# EAGLE design vr42-revA (EAGLE 9.6.2)

## Sheet 1 of 4
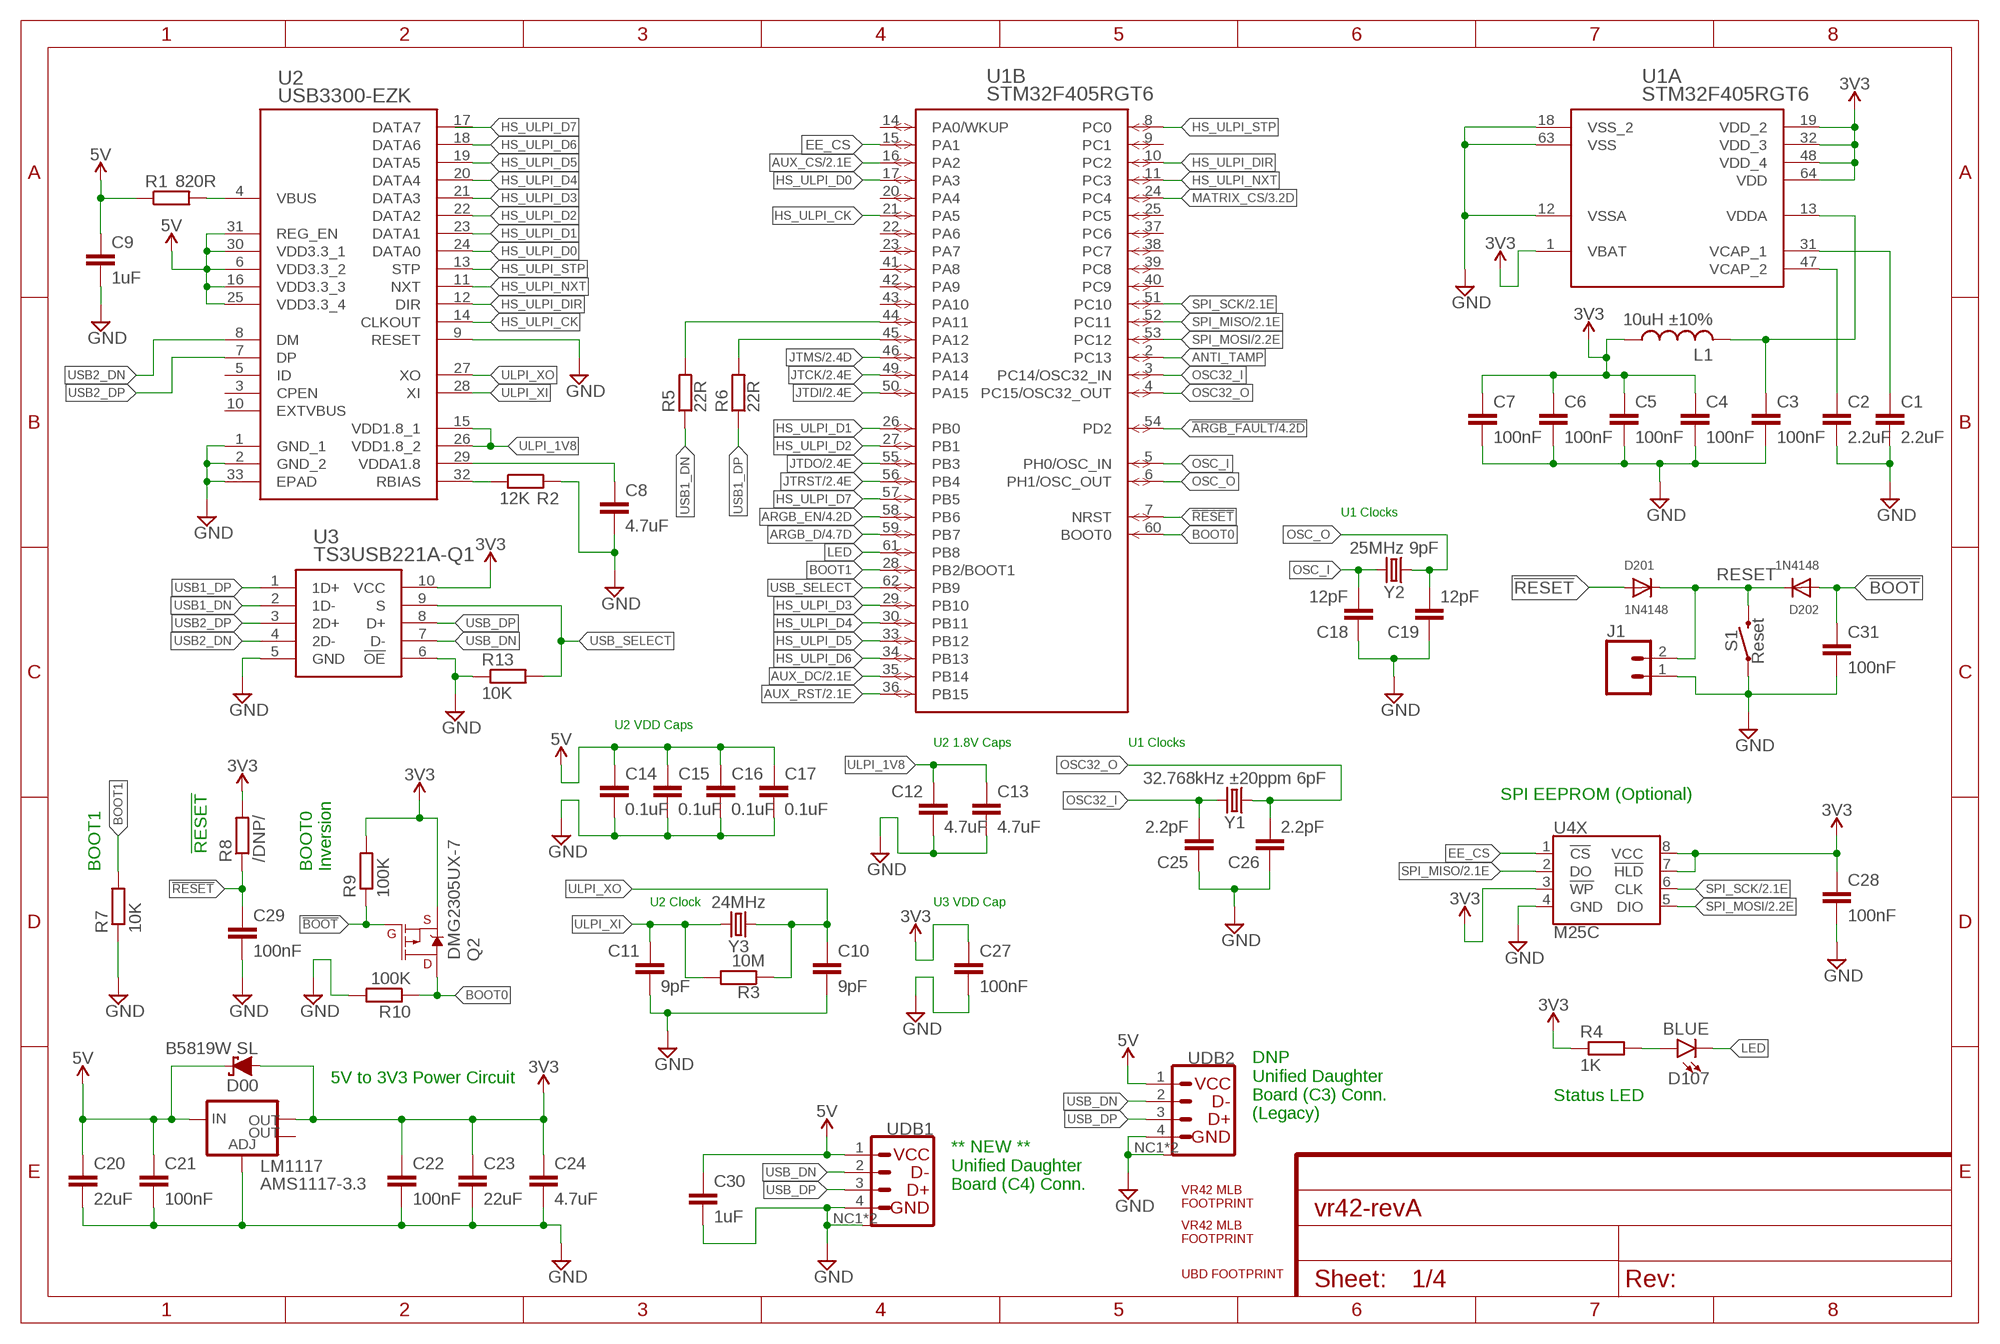
[diagram p0: schematic, sheet 1]

### Parts
C1  2.2uF  C-EUC0603  [C0603]
C2  2.2uF  C-EUC0603  [C0603]
C3  100nF  C-EUC0603  [C0603]
C4  100nF  C-EUC0603  [C0603]
C5  100nF  C-EUC0603  [C0603]
C6  100nF  C-EUC0603  [C0603]
C7  100nF  C-EUC0603  [C0603]
C8  4.7uF  C-EUC0603  [C0603]
C9  1uF  C-EUC0603  [C0603]
C10  9pF  C-EUC0603  [C0603]
C11  9pF  C-EUC0603  [C0603]
C12  4.7uF  C-EUC0603  [C0603]
C13  4.7uF  C-EUC0603  [C0603]
C14  0.1uF  C-EUC0603  [C0603]
C15  0.1uF  C-EUC0603  [C0603]
C16  0.1uF  C-EUC0603  [C0603]
C17  0.1uF  C-EUC0603  [C0603]
C18  12pF  C-EUC0603  [C0603]
C19  12pF  C-EUC0603  [C0603]
C20  22uF  0.22UF-0603-25V-10%  [0603]
C21  100nF  0.1UF-0603-25V-5%  [0603]
C22  100nF  0.1UF-0603-25V-5%  [0603]
C23  22uF  0.22UF-0603-25V-10%  [0603]
C24  4.7uF  1.0NF/1000PF-0603-50V-10%  [0603]
C25  2.2pF  C-EUC0603  [C0603]
C26  2.2pF  C-EUC0603  [C0603]
C27  100nF  C-EUC0603  [C0603]
C28  100nF  0.1UF-0603-25V-5%  [0603]
C29  100nF  C-EUC0603  [C0603]
C30  1uF  C-EUC0805  [C0805]
C31  100nF  C-EUC0805  [C0805]
D00  B5819W SL  1N5819WS  [SOD-123]
D107  BLUE  LED-BLUE0603  [LED-0603]
D201  1N4148  DIODESOT23_REFLOW  [SOT23-R]
D202  1N4148  DIODESOT23_REFLOW  [SOT23-R]
J1  CONN_02  [1X02]
L1  10uH ±10%  L-USL3225M  [L3225M]
LM1117  AMS1117-3.3  V_REG_LM1117SOT223  [SOT223]
Q2  DMG2305UX-7  MOSFET_PCH-DMG2305UX-7  [SOT23-3]
R1  820R  R-EU_R0603  [R0603]
R2  12K  R-EU_R0603  [R0603]
R3  10M  R-EU_R0603  [R0603]
R4  1K  R-EU_R0603  [R0603]
R5  22R  R-EU_R0603  [R0603]
R6  22R  R-EU_R0603  [R0603]
R7  10K  R-EU_R0603  [R0603]
R8  /DNP/  R-EU_R0603  [R0603]
R9  100K  R-EU_R0603  [R0603]
R10  100K  R-EU_R0603  [R0603]
R13  10K  R-EU_R0603  [R0603]
S1  Reset  MOMENTARY-SWITCH-SPST-SMD-5.2-TALL-REDUNDANT  [TACTILE_SWITCH_SMD_5.2MM]
U1  STM32F405RGT6  [LQFP64-10X10MM]
U2  USB3300-EZK  [QFN32_5X5MC_MCH]
U3  TS3USB221A-Q1  [RSE10]
U4X  M25C  [8-SOIC]
U$1  VR42_MLB_FOOTPRINT  [VR42_MLB_FOOTPRINT]
U$6  VR42_MLB_FOOTPRINT  [VR42_MLB_FOOTPRINT]
U$7  UBD_FOOTPRINT  [UDB_FOOTPRINT]
UDB1  UBD-S1_C4  [MOLEX_781710004]
UDB2  UBD-C3  [JST_SM04B-SRSS-TB_LF_SN]
Y1  32.768kHz ±20ppm 6pF  CRYSTAL-32.768KHZSMD-3.2X1.5  [CRYSTAL-SMD-3.2X1.5MM]
Y2  25MHz 9pF  CRYSTAL-24MHZ"  [CRYSTAL-SMD-5X3.2-4PAD]
Y3  24MHz  CRYSTAL-24MHZ"  [CRYSTAL-SMD-5X3.2-4PAD]

### Nets
!ARGB_FAULT: U1.54(B:PD2) ; also sheet 4
!BOOT: C31.1 D202.1(A) Q2.1(G) R9.1
!RESET: C29.1 D201.1(A) R8.1 U1.7(B:NRST)
ANTI_TAMP: U1.2(B:PC13)
ARGB_D: U1.59(B:PB7) ; also sheet 4
ARGB_EN: U1.58(B:PB6) ; also sheet 4
AUX_CS: U1.16(B:PA2) ; also sheet 2
AUX_DC: U1.35(B:PB14) ; also sheet 2
AUX_RST: U1.36(B:PB15) ; also sheet 2
BOOT0: Q2.3(D) R10.1 U1.60(B:BOOT0)
BOOT1: R7.2 U1.28(B:PB2/BOOT1)
EE_CS: U1.15(B:PA1) U4X.1(!CS)
GND: C1.2 C2.2 C3.2 C4.2 C5.2 C6.2 C7.2 C8.2 C9.2 C10.2 C11.2 C12.2 C13.2 C14.2 C15.2 C16.2 C17.2 C18.1 C19.1 C20.2 C21.2 C22.2 C23.2 C24.2 C25.1 C26.1 C27.2 C28.2 C29.2 C30.2 C31.2 J1.1 LM1117.1(ADJ) R2.2 R7.1 R10.2 R13.1 S1.1 S1.2 U1.12(A:VSSA) U1.18(A:VSS_2) U1.63(A:VSS) U2.1(GND_1) U2.2(GND_2) U2.9(RESET) U2.33(EPAD) U3.5(GND) U3.6(!OE) U4X.4(GND) UDB1.4(GND) UDB1.NC1(M) UDB1.NC2(M) UDB2.4(GND) UDB2.NC1(M) UDB2.NC2(M) ; also sheet 2,3,4
HS_ULPI_CK: U1.21(B:PA5) U2.14(CLKOUT)
HS_ULPI_D0: U1.17(B:PA3) U2.24(DATA0)
HS_ULPI_D1: U1.26(B:PB0) U2.23(DATA1)
HS_ULPI_D2: U1.27(B:PB1) U2.22(DATA2)
HS_ULPI_D3: U1.29(B:PB10) U2.21(DATA3)
HS_ULPI_D4: U1.30(B:PB11) U2.20(DATA4)
HS_ULPI_D5: U1.33(B:PB12) U2.19(DATA5)
HS_ULPI_D6: U1.34(B:PB13) U2.18(DATA6)
HS_ULPI_D7: U1.57(B:PB5) U2.17(DATA7)
HS_ULPI_DIR: U1.10(B:PC2) U2.12(DIR)
HS_ULPI_NXT: U1.11(B:PC3) U2.11(NXT)
HS_ULPI_STP: U1.8(B:PC0) U2.13(STP)
JTCK: U1.49(B:PA14) ; also sheet 2
JTDI: U1.50(B:PA15) ; also sheet 2
JTDO: U1.55(B:PB3) ; also sheet 2
JTMS: U1.46(B:PA13) ; also sheet 2
JTRST: U1.56(B:PB4) ; also sheet 2
LED: D107.C U1.61(B:PB8)
MATRIX_CS: U1.24(B:PC4) ; also sheet 3
N$9: R1.2 U2.4(VBUS)
N$10: R2.1 U2.32(RBIAS)
N$19: C8.1 U2.29(VDDA1.8)
N$140: R5.2 U1.44(B:PA11)
N$141: R6.2 U1.45(B:PA12)
N$145: D107.A R4.2
OSC32_I: C25.2 U1.3(B:PC14/OSC32_IN) Y1.P$2
OSC32_O: C26.2 U1.4(B:PC15/OSC32_OUT) Y1.P$1
OSC_I: C18.2 U1.5(B:PH0/OSC_IN) Y2.3
OSC_O: C19.2 U1.6(B:PH1/OSC_OUT) Y2.1
RESET: D201.3(C) D202.3(C) J1.2 S1.3 S1.4
SPI_MISO: U1.52(B:PC11) U4X.2(DO) ; also sheet 2,3
SPI_MOSI: U1.53(B:PC12) U4X.5(DIO) ; also sheet 2,3
SPI_SCK: U1.51(B:PC10) U4X.6(CLK) ; also sheet 2,3
ULPI_1V8: C12.1 C13.1 U2.15(VDD1.8_1) U2.26(VDD1.8_2)
ULPI_XI: C11.1 R3.2 U2.28(XI) Y3.3
ULPI_XO: C10.1 R3.1 U2.27(XO) Y3.1
USB1_DN: R5.1 U3.2(1D-)
USB1_DP: R6.1 U3.1(1D+)
USB2_DN: U2.8(DM) U3.4(2D-)
USB2_DP: U2.7(DP) U3.3(2D+)
USB_DN: U3.7(D-) UDB1.2(DN) UDB2.2(DN)
USB_DP: U3.8(D+) UDB1.3(DP) UDB2.3(DP)
USB_SELECT: R13.2 U1.62(B:PB9) U3.9(S)
VCAP_1: C1.1 U1.31(A:VCAP_1)
VCAP_2: C2.1 U1.47(A:VCAP_2)
VCC_1: C9.1 C14.1 C15.1 C16.1 C17.1 C20.1 C21.1 C30.1 D00.C LM1117.3(IN) R1.1 U2.6(VDD3.3_2) U2.16(VDD3.3_3) U2.25(VDD3.3_4) U2.30(VDD3.3_1) U2.31(REG_EN) UDB1.1(VCC) UDB2.1(VCC) ; supply symbol labelled 5V ; also sheet 4
VCC_2: C4.1 C5.1 C6.1 C7.1 C22.1 C23.1 C24.1 C27.1 C28.1 D00.A L1.1 LM1117.2(OUT) Q2.2(S) R4.1 R8.2 R9.2 U1.1(A:VBAT) U1.19(A:VDD_2) U1.32(A:VDD_3) U1.48(A:VDD_4) U1.64(A:VDD) U3.10(VCC) U4X.3(!WP) U4X.7(!HLD) U4X.8(VCC) ; supply symbol labelled 3V3 ; also sheet 2,3
VDDA: C3.1 L1.2 U1.13(A:VDDA)
Unconnected: LM1117.4(OUT) U1.9(B:PC1) U1.14(B:PA0/WKUP) U1.20(B:PA4) U1.22(B:PA6) U1.23(B:PA7) U1.25(B:PC5) U1.37(B:PC6) U1.38(B:PC7) U1.39(B:PC8) U1.40(B:PC9) U1.41(B:PA8) U1.42(B:PA9) U1.43(B:PA10) U2.3(CPEN) U2.5(ID) U2.10(EXTVBUS)

### Notes on the sheet
- U1 Clocks
- U2 VDD Caps
- U2 1.8V Caps | U1 Clocks
- SPI EEPROM (Optional)
- !RESET
- BOOT1
- BOOT0
  Inversion
- U2 Clock | U3 VDD Cap
- 5V to 3V3 Power Circuit
- Status LED
- DNP
  Unified Daughter
  Board (C3) Conn.
  (Legacy)
- ** NEW **
  Unified Daughter
  Board (C4) Conn.

## Sheet 2 of 4
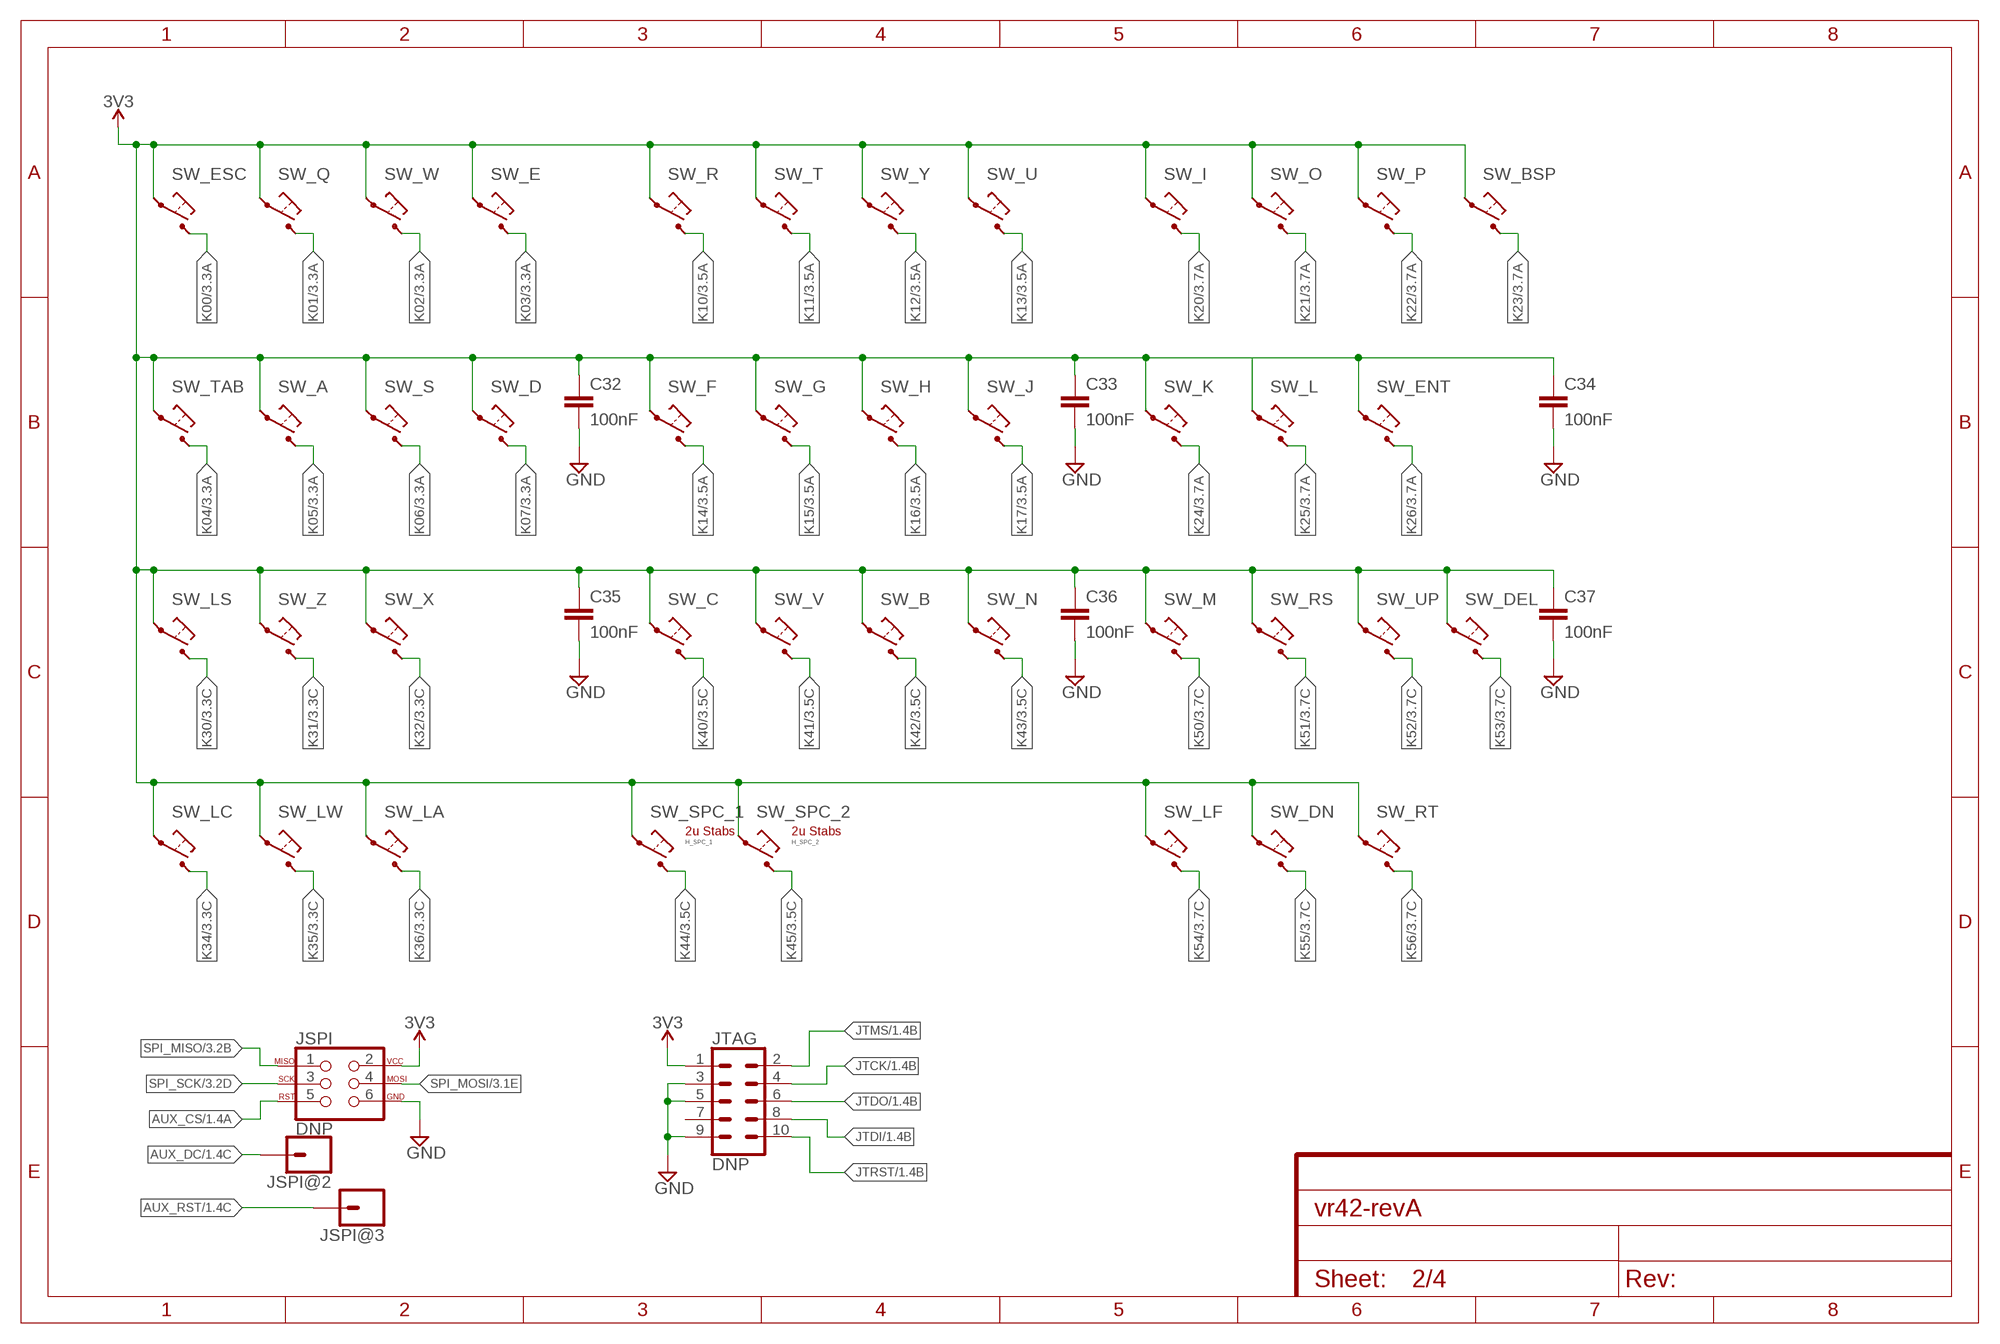
[diagram p1: schematic, sheet 2]

### Parts
C32  100nF  C-EUC0603  [C0603]
C33  100nF  C-EUC0603  [C0603]
C34  100nF  C-EUC0603  [C0603]
C35  100nF  C-EUC0603  [C0603]
C36  100nF  C-EUC0603  [C0603]
C37  100nF  C-EUC0603  [C0603]
H_SPC_1  MX-STABS-200U  [MX-STABS-200U]
H_SPC_2  MX-STABS-200U  [MX-STABS-200U]
JSPI  DNP  AVR_SPI_PROG_3X2NS  [2X3-NS]
JSPI@2  CONN_01  [1X01]
JSPI@3  CONN_01  [1X01]
JTAG  DNP  CONN_05X2NO_SILK  [2X5_NOSILK]
SW_A  MX-5-PIN-HOTSWAP-PAD  [MX-5-PIN-HOTSWAP-PAD]
SW_B  MX-5-PIN-HOTSWAP-PAD  [MX-5-PIN-HOTSWAP-PAD]
SW_BSP  MX-5-PIN-HOTSWAP-PAD  [MX-5-PIN-HOTSWAP-PAD]
SW_C  MX-5-PIN-HOTSWAP-PAD  [MX-5-PIN-HOTSWAP-PAD]
SW_D  MX-5-PIN-HOTSWAP-PAD  [MX-5-PIN-HOTSWAP-PAD]
SW_DEL  MX-5-PIN-HOTSWAP-PAD  [MX-5-PIN-HOTSWAP-PAD]
SW_DN  MX-5-PIN-HOTSWAP-PAD  [MX-5-PIN-HOTSWAP-PAD]
SW_E  MX-5-PIN-HOTSWAP-PAD  [MX-5-PIN-HOTSWAP-PAD]
SW_ENT  MX-5-PIN-HOTSWAP-PAD  [MX-5-PIN-HOTSWAP-PAD]
SW_ESC  MX-5-PIN-HOTSWAP-PAD  [MX-5-PIN-HOTSWAP-PAD]
SW_F  MX-5-PIN-HOTSWAP-PAD  [MX-5-PIN-HOTSWAP-PAD]
SW_G  MX-5-PIN-HOTSWAP-PAD  [MX-5-PIN-HOTSWAP-PAD]
SW_H  MX-5-PIN-HOTSWAP-PAD  [MX-5-PIN-HOTSWAP-PAD]
SW_I  MX-5-PIN-HOTSWAP-PAD  [MX-5-PIN-HOTSWAP-PAD]
SW_J  MX-5-PIN-HOTSWAP-PAD  [MX-5-PIN-HOTSWAP-PAD]
SW_K  MX-5-PIN-HOTSWAP-PAD  [MX-5-PIN-HOTSWAP-PAD]
SW_L  MX-5-PIN-HOTSWAP-PAD  [MX-5-PIN-HOTSWAP-PAD]
SW_LA  MX-5-PIN-HOTSWAP-PAD  [MX-5-PIN-HOTSWAP-PAD]
SW_LC  MX-5-PIN-HOTSWAP-PAD  [MX-5-PIN-HOTSWAP-PAD]
SW_LF  MX-5-PIN-HOTSWAP-PAD  [MX-5-PIN-HOTSWAP-PAD]
SW_LS  MX-5-PIN-HOTSWAP-PAD  [MX-5-PIN-HOTSWAP-PAD]
SW_LW  MX-5-PIN-HOTSWAP-PAD  [MX-5-PIN-HOTSWAP-PAD]
SW_M  MX-5-PIN-HOTSWAP-PAD  [MX-5-PIN-HOTSWAP-PAD]
SW_N  MX-5-PIN-HOTSWAP-PAD  [MX-5-PIN-HOTSWAP-PAD]
SW_O  MX-5-PIN-HOTSWAP-PAD  [MX-5-PIN-HOTSWAP-PAD]
SW_P  MX-5-PIN-HOTSWAP-PAD  [MX-5-PIN-HOTSWAP-PAD]
SW_Q  MX-5-PIN-HOTSWAP-PAD  [MX-5-PIN-HOTSWAP-PAD]
SW_R  MX-5-PIN-HOTSWAP-PAD  [MX-5-PIN-HOTSWAP-PAD]
SW_RS  MX-5-PIN-HOTSWAP-PAD  [MX-5-PIN-HOTSWAP-PAD]
SW_RT  MX-5-PIN-HOTSWAP-PAD  [MX-5-PIN-HOTSWAP-PAD]
SW_S  MX-5-PIN-HOTSWAP-PAD  [MX-5-PIN-HOTSWAP-PAD]
SW_SPC_1  MX-5-PIN-HOTSWAP-PAD  [MX-5-PIN-HOTSWAP-PAD]
SW_SPC_2  MX-5-PIN-HOTSWAP-PAD  [MX-5-PIN-HOTSWAP-PAD]
SW_T  MX-5-PIN-HOTSWAP-PAD  [MX-5-PIN-HOTSWAP-PAD]
SW_TAB  MX-5-PIN-HOTSWAP-PAD  [MX-5-PIN-HOTSWAP-PAD]
SW_U  MX-5-PIN-HOTSWAP-PAD  [MX-5-PIN-HOTSWAP-PAD]
SW_UP  MX-5-PIN-HOTSWAP-PAD  [MX-5-PIN-HOTSWAP-PAD]
SW_V  MX-5-PIN-HOTSWAP-PAD  [MX-5-PIN-HOTSWAP-PAD]
SW_W  MX-5-PIN-HOTSWAP-PAD  [MX-5-PIN-HOTSWAP-PAD]
SW_X  MX-5-PIN-HOTSWAP-PAD  [MX-5-PIN-HOTSWAP-PAD]
SW_Y  MX-5-PIN-HOTSWAP-PAD  [MX-5-PIN-HOTSWAP-PAD]
SW_Z  MX-5-PIN-HOTSWAP-PAD  [MX-5-PIN-HOTSWAP-PAD]

### Nets
AUX_CS: JSPI.5 ; also sheet 1
AUX_DC: JSPI@2.1 ; also sheet 1
AUX_RST: JSPI@3.1 ; also sheet 1
GND: C32.2 C33.2 C34.2 C35.2 C36.2 C37.2 JSPI.6 JTAG.3 JTAG.5 JTAG.9 ; also sheet 1,3,4
JTCK: JTAG.4 ; also sheet 1
JTDI: JTAG.8 ; also sheet 1
JTDO: JTAG.6 ; also sheet 1
JTMS: JTAG.2 ; also sheet 1
JTRST: JTAG.10 ; also sheet 1
K00: SW_ESC.1@1(P) SW_ESC.1@2(P) ; also sheet 3
K01: SW_Q.1@1(P) SW_Q.1@2(P) ; also sheet 3
K02: SW_W.1@1(P) SW_W.1@2(P) ; also sheet 3
K03: SW_E.1@1(P) SW_E.1@2(P) ; also sheet 3
K04: SW_TAB.1@1(P) SW_TAB.1@2(P) ; also sheet 3
K05: SW_A.1@1(P) SW_A.1@2(P) ; also sheet 3
K06: SW_S.1@1(P) SW_S.1@2(P) ; also sheet 3
K07: SW_D.1@1(P) SW_D.1@2(P) ; also sheet 3
K10: SW_R.1@1(P) SW_R.1@2(P) ; also sheet 3
K11: SW_T.1@1(P) SW_T.1@2(P) ; also sheet 3
K12: SW_Y.1@1(P) SW_Y.1@2(P) ; also sheet 3
K13: SW_U.1@1(P) SW_U.1@2(P) ; also sheet 3
K14: SW_F.1@1(P) SW_F.1@2(P) ; also sheet 3
K15: SW_G.1@1(P) SW_G.1@2(P) ; also sheet 3
K16: SW_H.1@1(P) SW_H.1@2(P) ; also sheet 3
K17: SW_J.1@1(P) SW_J.1@2(P) ; also sheet 3
K20: SW_I.1@1(P) SW_I.1@2(P) ; also sheet 3
K21: SW_O.1@1(P) SW_O.1@2(P) ; also sheet 3
K22: SW_P.1@1(P) SW_P.1@2(P) ; also sheet 3
K23: SW_BSP.1@1(P) SW_BSP.1@2(P) ; also sheet 3
K24: SW_K.1@1(P) SW_K.1@2(P) ; also sheet 3
K25: SW_L.1@1(P) SW_L.1@2(P) ; also sheet 3
K26: SW_ENT.1@1(P) SW_ENT.1@2(P) ; also sheet 3
K30: SW_LS.1@1(P) SW_LS.1@2(P) ; also sheet 3
K31: SW_Z.1@1(P) SW_Z.1@2(P) ; also sheet 3
K32: SW_X.1@1(P) SW_X.1@2(P) ; also sheet 3
K34: SW_LC.1@1(P) SW_LC.1@2(P) ; also sheet 3
K35: SW_LW.1@1(P) SW_LW.1@2(P) ; also sheet 3
K36: SW_LA.1@1(P) SW_LA.1@2(P) ; also sheet 3
K40: SW_C.1@1(P) SW_C.1@2(P) ; also sheet 3
K41: SW_V.1@1(P) SW_V.1@2(P) ; also sheet 3
K42: SW_B.1@1(P) SW_B.1@2(P) ; also sheet 3
K43: SW_N.1@1(P) SW_N.1@2(P) ; also sheet 3
K44: SW_SPC_1.1@1(P) SW_SPC_1.1@2(P) ; also sheet 3
K45: SW_SPC_2.1@1(P) SW_SPC_2.1@2(P) ; also sheet 3
K50: SW_M.1@1(P) SW_M.1@2(P) ; also sheet 3
K51: SW_RS.1@1(P) SW_RS.1@2(P) ; also sheet 3
K52: SW_UP.1@1(P) SW_UP.1@2(P) ; also sheet 3
K53: SW_DEL.1@1(P) SW_DEL.1@2(P) ; also sheet 3
K54: SW_LF.1@1(P) SW_LF.1@2(P) ; also sheet 3
K55: SW_DN.1@1(P) SW_DN.1@2(P) ; also sheet 3
K56: SW_RT.1@1(P) SW_RT.1@2(P) ; also sheet 3
SPI_MISO: JSPI.1 ; also sheet 1,3
SPI_MOSI: JSPI.4 ; also sheet 1,3
SPI_SCK: JSPI.3 ; also sheet 1,3
VCC_2: C32.1 C33.1 C34.1 C35.1 C36.1 C37.1 JSPI.2 JTAG.1 SW_A.2@1(S) SW_A.2@2(S) SW_B.2@1(S) SW_B.2@2(S) SW_BSP.2@1(S) SW_BSP.2@2(S) SW_C.2@1(S) SW_C.2@2(S) SW_D.2@1(S) SW_D.2@2(S) SW_DEL.2@1(S) SW_DEL.2@2(S) SW_DN.2@1(S) SW_DN.2@2(S) SW_E.2@1(S) SW_E.2@2(S) SW_ENT.2@1(S) SW_ENT.2@2(S) SW_ESC.2@1(S) SW_ESC.2@2(S) SW_F.2@1(S) SW_F.2@2(S) SW_G.2@1(S) SW_G.2@2(S) SW_H.2@1(S) SW_H.2@2(S) SW_I.2@1(S) SW_I.2@2(S) SW_J.2@1(S) SW_J.2@2(S) SW_K.2@1(S) SW_K.2@2(S) SW_L.2@1(S) SW_L.2@2(S) SW_LA.2@1(S) SW_LA.2@2(S) SW_LC.2@1(S) SW_LC.2@2(S) SW_LF.2@1(S) SW_LF.2@2(S) SW_LS.2@1(S) SW_LS.2@2(S) SW_LW.2@1(S) SW_LW.2@2(S) SW_M.2@1(S) SW_M.2@2(S) SW_N.2@1(S) SW_N.2@2(S) SW_O.2@1(S) SW_O.2@2(S) SW_P.2@1(S) SW_P.2@2(S) SW_Q.2@1(S) SW_Q.2@2(S) SW_R.2@1(S) SW_R.2@2(S) SW_RS.2@1(S) SW_RS.2@2(S) SW_RT.2@1(S) SW_RT.2@2(S) SW_S.2@1(S) SW_S.2@2(S) SW_SPC_1.2@1(S) SW_SPC_1.2@2(S) SW_SPC_2.2@1(S) SW_SPC_2.2@2(S) SW_T.2@1(S) SW_T.2@2(S) SW_TAB.2@1(S) SW_TAB.2@2(S) SW_U.2@1(S) SW_U.2@2(S) SW_UP.2@1(S) SW_UP.2@2(S) SW_V.2@1(S) SW_V.2@2(S) SW_W.2@1(S) SW_W.2@2(S) SW_X.2@1(S) SW_X.2@2(S) SW_Y.2@1(S) SW_Y.2@2(S) SW_Z.2@1(S) SW_Z.2@2(S) ; supply symbol labelled 3V3 ; also sheet 1,3
Unconnected: JTAG.7

## Sheet 3 of 4
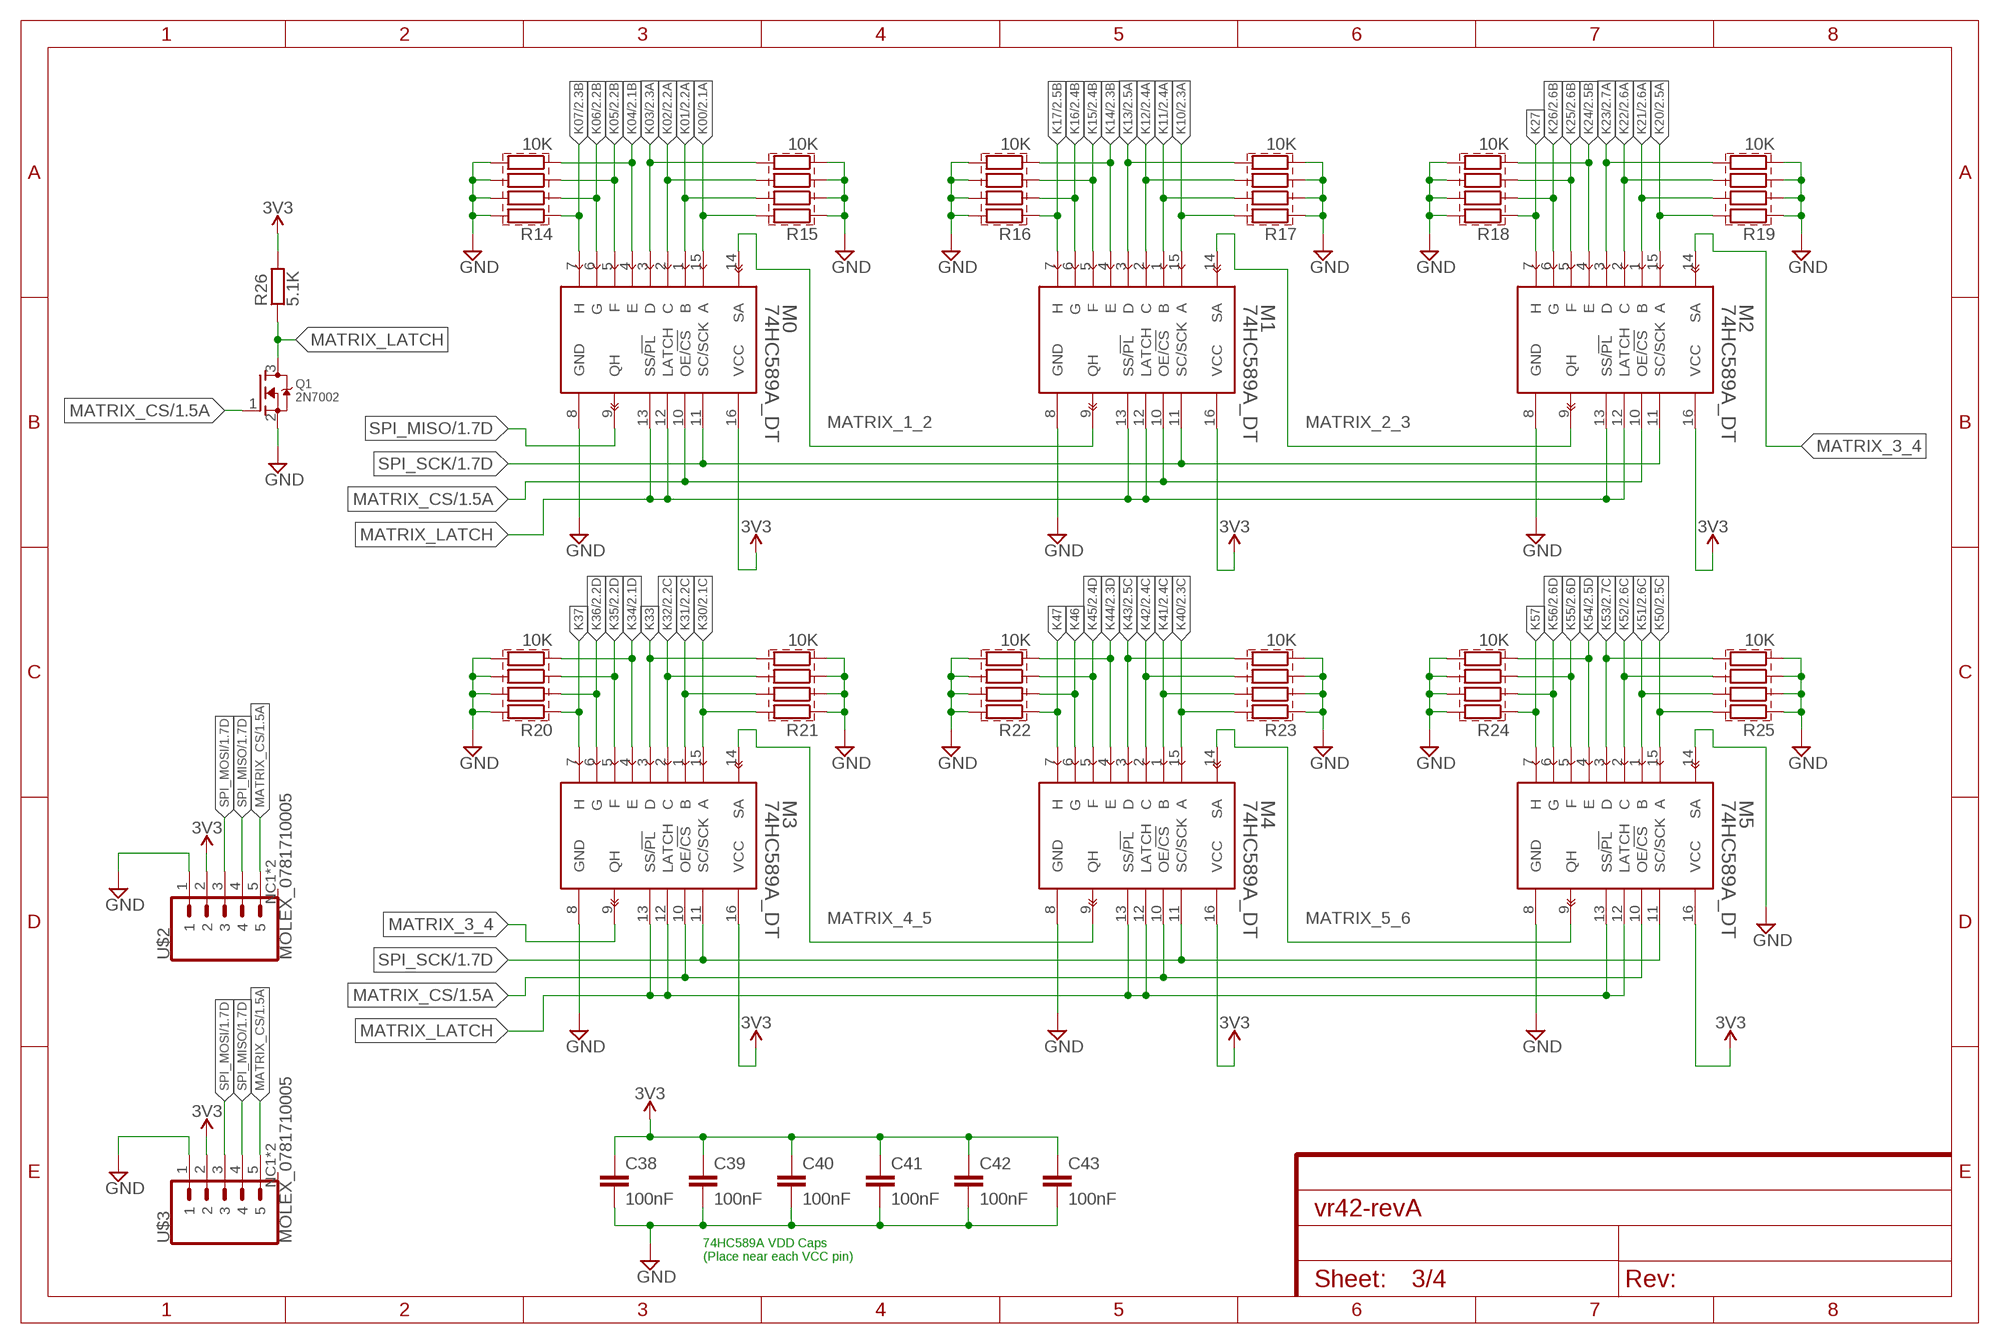
[diagram p2: schematic, sheet 3]

### Parts
C38  100nF  0.1UF-0603-25V-5%  [0603]
C39  100nF  0.1UF-0603-25V-5%  [0603]
C40  100nF  0.1UF-0603-25V-5%  [0603]
C41  100nF  0.1UF-0603-25V-5%  [0603]
C42  100nF  0.1UF-0603-25V-5%  [0603]
C43  100nF  0.1UF-0603-25V-5%  [0603]
M0  74HC589A_DT  [TSSOP16]
M1  74HC589A_DT  [TSSOP16]
M2  74HC589A_DT  [TSSOP16]
M3  74HC589A_DT  [TSSOP16]
M4  74HC589A_DT  [TSSOP16]
M5  74HC589A_DT  [TSSOP16]
Q1  2N7002  MOSFET-NREFLOW  [SOT23]
R14  10K  R-EU-4  [R0603X4]
R15  10K  R-EU-4  [R0603X4]
R16  10K  R-EU-4  [R0603X4]
R17  10K  R-EU-4  [R0603X4]
R18  10K  R-EU-4  [R0603X4]
R19  10K  R-EU-4  [R0603X4]
R20  10K  R-EU-4  [R0603X4]
R21  10K  R-EU-4  [R0603X4]
R22  10K  R-EU-4  [R0603X4]
R23  10K  R-EU-4  [R0603X4]
R24  10K  R-EU-4  [R0603X4]
R25  10K  R-EU-4  [R0603X4]
R26  5.1K  R-EU_R0603  [R0603]
U$2  MOLEX_0781710005  [MOLEX_781710005]
U$3  MOLEX_0781710005  [MOLEX_781710005]

### Nets
GND: C38.2 C39.2 C40.2 C41.2 C42.2 C43.2 M0.8(GND) M1.8(GND) M2.8(GND) M3.8(GND) M4.8(GND) M5.8(GND) M5.14(SA) Q1.2(S) R14.5 R14.6 R14.7 R14.8 R15.1 R15.2 R15.3 R15.4 R16.5 R16.6 R16.7 R16.8 R17.1 R17.2 R17.3 R17.4 R18.5 R18.6 R18.7 R18.8 R19.1 R19.2 R19.3 R19.4 R20.5 R20.6 R20.7 R20.8 R21.1 R21.2 R21.3 R21.4 R22.5 R22.6 R22.7 R22.8 R23.1 R23.2 R23.3 R23.4 R24.5 R24.6 R24.7 R24.8 R25.1 R25.2 R25.3 R25.4 U$2.1 U$3.1 ; also sheet 1,2,4
K00: M0.15(A) R15.8 ; also sheet 2
K01: M0.1(B) R15.7 ; also sheet 2
K02: M0.2(C) R15.6 ; also sheet 2
K03: M0.3(D) R15.5 ; also sheet 2
K04: M0.4(E) R14.4 ; also sheet 2
K05: M0.5(F) R14.3 ; also sheet 2
K06: M0.6(G) R14.2 ; also sheet 2
K07: M0.7(H) R14.1 ; also sheet 2
K10: M1.15(A) R17.8 ; also sheet 2
K11: M1.1(B) R17.7 ; also sheet 2
K12: M1.2(C) R17.6 ; also sheet 2
K13: M1.3(D) R17.5 ; also sheet 2
K14: M1.4(E) R16.4 ; also sheet 2
K15: M1.5(F) R16.3 ; also sheet 2
K16: M1.6(G) R16.2 ; also sheet 2
K17: M1.7(H) R16.1 ; also sheet 2
K20: M2.15(A) R19.8 ; also sheet 2
K21: M2.1(B) R19.7 ; also sheet 2
K22: M2.2(C) R19.6 ; also sheet 2
K23: M2.3(D) R19.5 ; also sheet 2
K24: M2.4(E) R18.4 ; also sheet 2
K25: M2.5(F) R18.3 ; also sheet 2
K26: M2.6(G) R18.2 ; also sheet 2
K27: M2.7(H) R18.1
K30: M3.15(A) R21.8 ; also sheet 2
K31: M3.1(B) R21.7 ; also sheet 2
K32: M3.2(C) R21.6 ; also sheet 2
K33: M3.3(D) R21.5
K34: M3.4(E) R20.4 ; also sheet 2
K35: M3.5(F) R20.3 ; also sheet 2
K36: M3.6(G) R20.2 ; also sheet 2
K37: M3.7(H) R20.1
K40: M4.15(A) R23.8 ; also sheet 2
K41: M4.1(B) R23.7 ; also sheet 2
K42: M4.2(C) R23.6 ; also sheet 2
K43: M4.3(D) R23.5 ; also sheet 2
K44: M4.4(E) R22.4 ; also sheet 2
K45: M4.5(F) R22.3 ; also sheet 2
K46: M4.6(G) R22.2
K47: M4.7(H) R22.1
K50: M5.15(A) R25.8 ; also sheet 2
K51: M5.1(B) R25.7 ; also sheet 2
K52: M5.2(C) R25.6 ; also sheet 2
K53: M5.3(D) R25.5 ; also sheet 2
K54: M5.4(E) R24.4 ; also sheet 2
K55: M5.5(F) R24.3 ; also sheet 2
K56: M5.6(G) R24.2 ; also sheet 2
K57: M5.7(H) R24.1
MATRIX_1_2: M0.14(SA) M1.9(QH)
MATRIX_2_3: M1.14(SA) M2.9(QH)
MATRIX_3_4: M2.14(SA) M3.9(QH)
MATRIX_4_5: M3.14(SA) M4.9(QH)
MATRIX_5_6: M4.14(SA) M5.9(QH)
MATRIX_CS: M0.10(OE/!CS) M1.10(OE/!CS) M2.10(OE/!CS) M3.10(OE/!CS) M4.10(OE/!CS) M5.10(OE/!CS) Q1.1(G) U$2.5 U$3.5 ; also sheet 1
MATRIX_LATCH: M0.12(LATCH) M0.13(SS/!PL) M1.12(LATCH) M1.13(SS/!PL) M2.12(LATCH) M2.13(SS/!PL) M3.12(LATCH) M3.13(SS/!PL) M4.12(LATCH) M4.13(SS/!PL) M5.12(LATCH) M5.13(SS/!PL) Q1.3(D) R26.1
SPI_MISO: M0.9(QH) U$2.4 U$3.4 ; also sheet 1,2
SPI_MOSI: U$2.3 U$3.3 ; also sheet 1,2
SPI_SCK: M0.11(SC/SCK) M1.11(SC/SCK) M2.11(SC/SCK) M3.11(SC/SCK) M4.11(SC/SCK) M5.11(SC/SCK) ; also sheet 1,2
VCC_2: C38.1 C39.1 C40.1 C41.1 C42.1 C43.1 M0.16(VCC) M1.16(VCC) M2.16(VCC) M3.16(VCC) M4.16(VCC) M5.16(VCC) R26.2 U$2.2 U$3.2 ; supply symbol labelled 3V3 ; also sheet 1,2
Unconnected: U$2.NC1(M) U$2.NC2(M) U$3.NC1(M) U$3.NC2(M)

### Notes on the sheet
- 74HC589A VDD Caps
  (Place near each VCC pin)

## Sheet 4 of 4
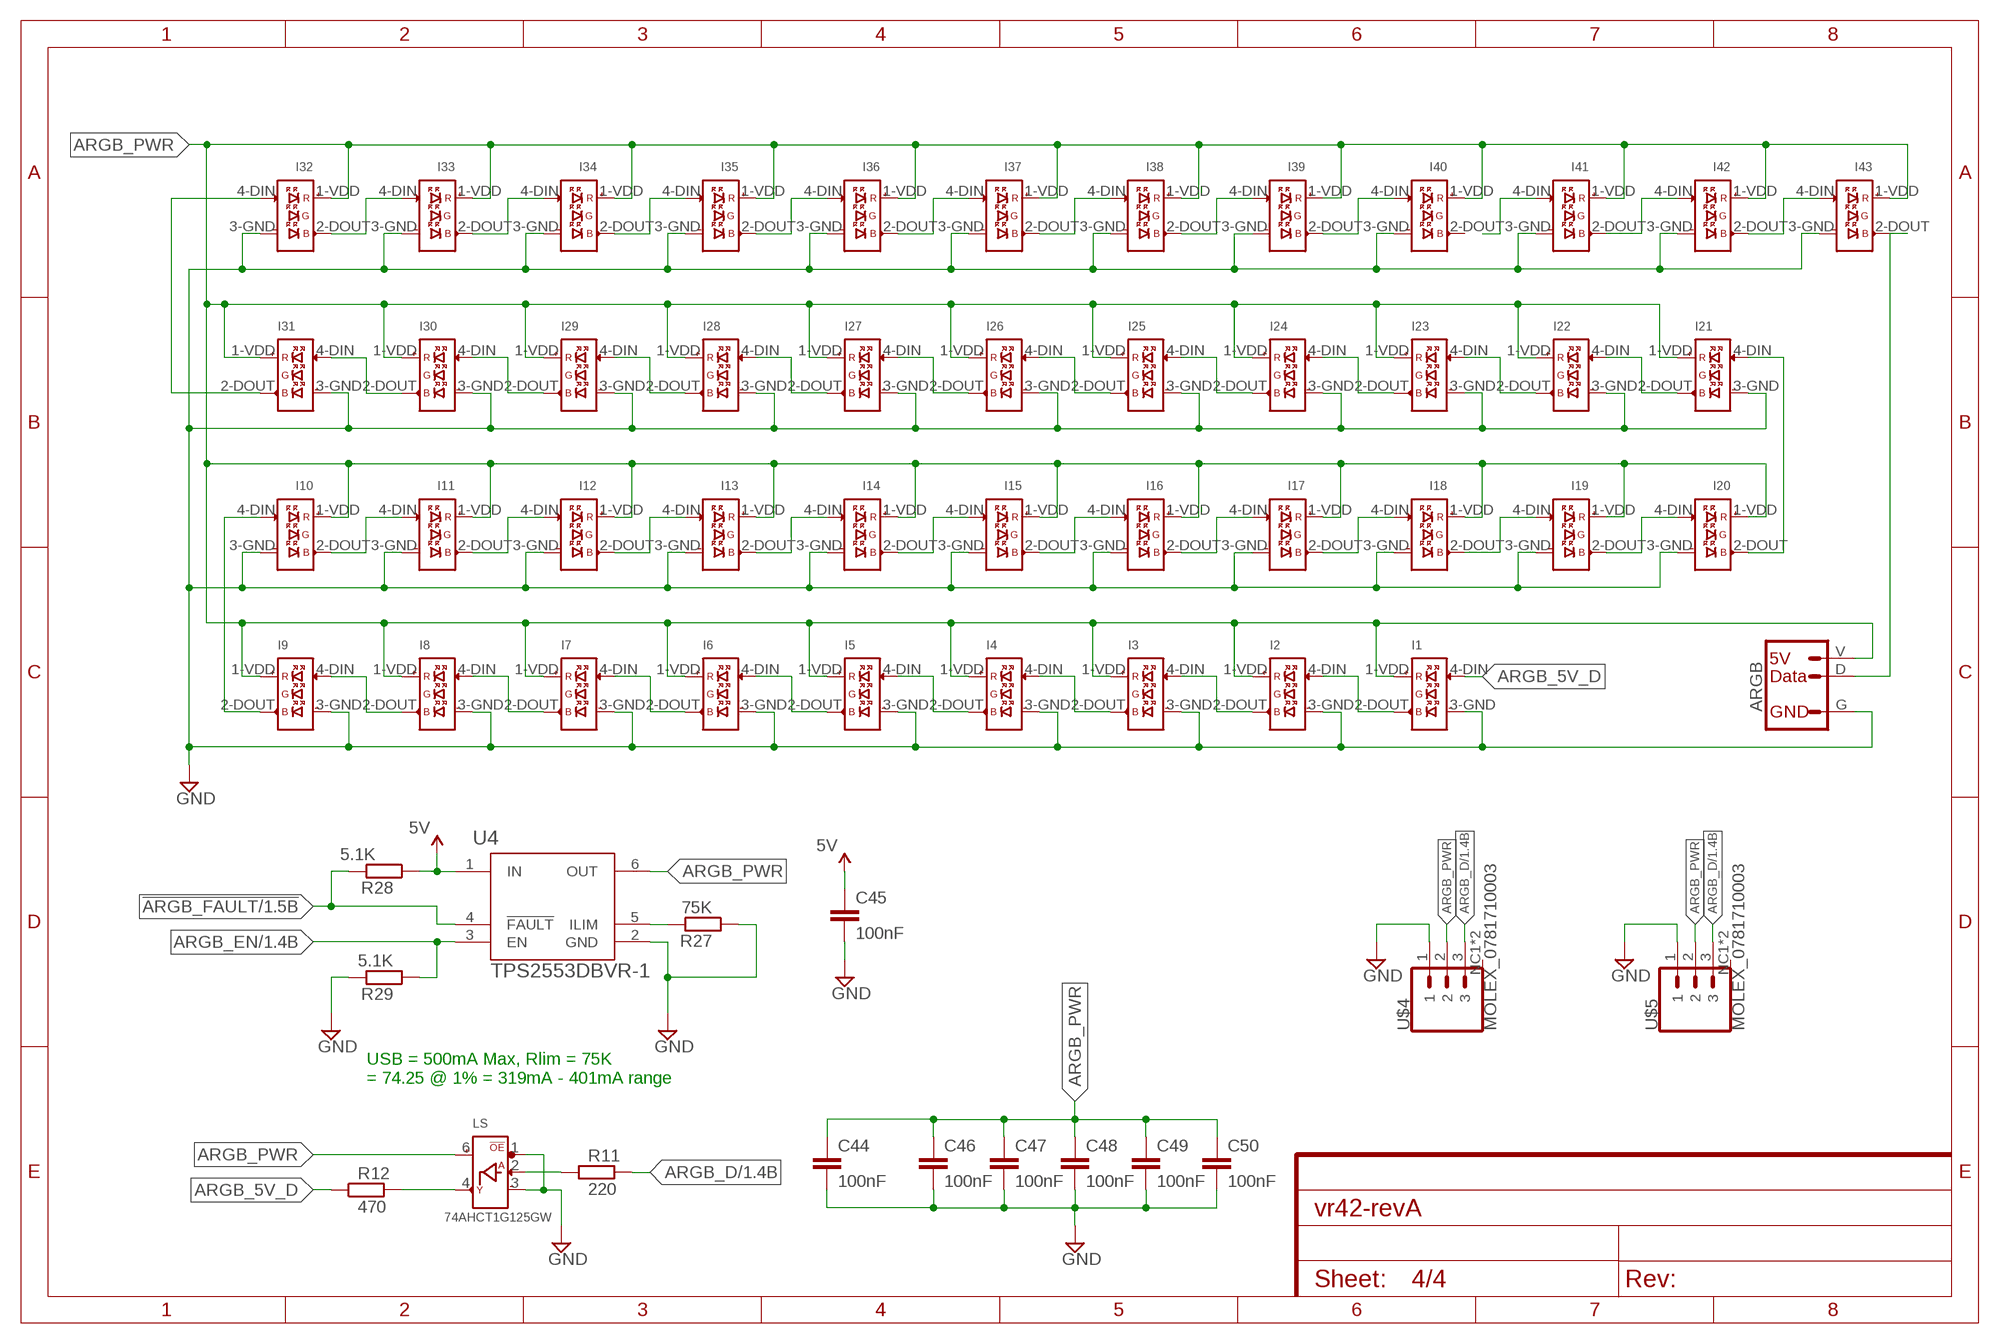
[diagram p3: schematic, sheet 4]

### Parts
C44  100nF  C-EUC0603  [C0603]
C45  100nF  C-EUC0603  [C0603]
C46  100nF  C-EUC0603  [C0603]
C47  100nF  C-EUC0603  [C0603]
C48  100nF  C-EUC0603  [C0603]
C49  100nF  C-EUC0603  [C0603]
C50  100nF  C-EUC0603  [C0603]
I1  SK6812-E-REVERSE  [SK6812-E-MILL]
I2  SK6812-E-REVERSE  [SK6812-E-MILL]
I3  SK6812-E-REVERSE  [SK6812-E-MILL]
I4  SK6812-E-REVERSE  [SK6812-E-MILL]
I5  SK6812-E-REVERSE  [SK6812-E-MILL]
I6  SK6812-E-REVERSE  [SK6812-E-MILL]
I7  SK6812-E-REVERSE  [SK6812-E-MILL]
I8  SK6812-E-REVERSE  [SK6812-E-MILL]
I9  SK6812-E-REVERSE  [SK6812-E-MILL]
I10  SK6812-E-REVERSE  [SK6812-E-MILL]
I11  SK6812-E-REVERSE  [SK6812-E-MILL]
I12  SK6812-E-REVERSE  [SK6812-E-MILL]
I13  SK6812-E-REVERSE  [SK6812-E-MILL]
I14  SK6812-E-REVERSE  [SK6812-E-MILL]
I15  SK6812-E-REVERSE  [SK6812-E-MILL]
I16  SK6812-E-REVERSE  [SK6812-E-MILL]
I17  SK6812-E-REVERSE  [SK6812-E-MILL]
I18  SK6812-E-REVERSE  [SK6812-E-MILL]
I19  SK6812-E-REVERSE  [SK6812-E-MILL]
I20  SK6812-E-REVERSE  [SK6812-E-MILL]
I21  SK6812-E-REVERSE  [SK6812-E-MILL]
I22  SK6812-E-REVERSE  [SK6812-E-MILL]
I23  SK6812-E-REVERSE  [SK6812-E-MILL]
I24  SK6812-E-REVERSE  [SK6812-E-MILL]
I25  SK6812-E-REVERSE  [SK6812-E-MILL]
I26  SK6812-E-REVERSE  [SK6812-E-MILL]
I27  SK6812-E-REVERSE  [SK6812-E-MILL]
I28  SK6812-E-REVERSE  [SK6812-E-MILL]
I29  SK6812-E-REVERSE  [SK6812-E-MILL]
I30  SK6812-E-REVERSE  [SK6812-E-MILL]
I31  SK6812-E-REVERSE  [SK6812-E-MILL]
I32  SK6812-E-REVERSE  [SK6812-E-MILL]
I33  SK6812-E-REVERSE  [SK6812-E-MILL]
I34  SK6812-E-REVERSE  [SK6812-E-MILL]
I35  SK6812-E-REVERSE  [SK6812-E-MILL]
I36  SK6812-E-REVERSE  [SK6812-E-MILL]
I37  SK6812-E-REVERSE  [SK6812-E-MILL]
I38  SK6812-E-REVERSE  [SK6812-E-MILL]
I39  SK6812-E-REVERSE  [SK6812-E-MILL]
I40  SK6812-E-REVERSE  [SK6812-E-MILL]
I41  SK6812-E-REVERSE  [SK6812-E-MILL]
I42  SK6812-E-REVERSE  [SK6812-E-MILL]
I43  SK6812-E-REVERSE  [SK6812-E-MILL]
I44  ARGB  [ARGB]
LS  74AHCT1G125GW  [SC-88A__TSSOP5__SOT353-1]
R11  220  R-EU_R0603  [R0603]
R12  470  R-EU_R0603  [R0603]
R27  75K  R-EU_R0603  [R0603]
R28  5.1K  R-EU_R0603  [R0603]
R29  5.1K  R-EU_R0603  [R0603]
U4  TPS2553DBVR-1  [DBV0006A_N]
U$4  MOLEX_0781710003  [MOLEX_781710003]
U$5  MOLEX_0781710003  [MOLEX_781710003]

### Nets
!ARGB_FAULT: R28.2 U4.4(!FAULT) ; also sheet 1
ARGB_5V_D: I1.4-DIN(4_DIN) R12.1
ARGB_D: R11.2 U$4.3 U$5.3 ; also sheet 1
ARGB_EN: R29.1 U4.3(EN) ; also sheet 1
ARGB_PWR: C44.1 C46.1 C47.1 C48.1 C49.1 C50.1 I1.1-VDD(1_VDD) I2.1-VDD(1_VDD) I3.1-VDD(1_VDD) I4.1-VDD(1_VDD) I5.1-VDD(1_VDD) I6.1-VDD(1_VDD) I7.1-VDD(1_VDD) I8.1-VDD(1_VDD) I9.1-VDD(1_VDD) I10.1-VDD(1_VDD) I11.1-VDD(1_VDD) I12.1-VDD(1_VDD) I13.1-VDD(1_VDD) I14.1-VDD(1_VDD) I15.1-VDD(1_VDD) I16.1-VDD(1_VDD) I17.1-VDD(1_VDD) I18.1-VDD(1_VDD) I19.1-VDD(1_VDD) I20.1-VDD(1_VDD) I21.1-VDD(1_VDD) I22.1-VDD(1_VDD) I23.1-VDD(1_VDD) I24.1-VDD(1_VDD) I25.1-VDD(1_VDD) I26.1-VDD(1_VDD) I27.1-VDD(1_VDD) I28.1-VDD(1_VDD) I29.1-VDD(1_VDD) I30.1-VDD(1_VDD) I31.1-VDD(1_VDD) I32.1-VDD(1_VDD) I33.1-VDD(1_VDD) I34.1-VDD(1_VDD) I35.1-VDD(1_VDD) I36.1-VDD(1_VDD) I37.1-VDD(1_VDD) I38.1-VDD(1_VDD) I39.1-VDD(1_VDD) I40.1-VDD(1_VDD) I41.1-VDD(1_VDD) I42.1-VDD(1_VDD) I43.1-VDD(1_VDD) I44.V LS.6(5_VCC) U4.6(OUT) U$4.2 U$5.2
GND: C44.2 C45.2 C46.2 C47.2 C48.2 C49.2 C50.2 I1.3-GND(3_GND) I2.3-GND(3_GND) I3.3-GND(3_GND) I4.3-GND(3_GND) I5.3-GND(3_GND) I6.3-GND(3_GND) I7.3-GND(3_GND) I8.3-GND(3_GND) I9.3-GND(3_GND) I10.3-GND(3_GND) I11.3-GND(3_GND) I12.3-GND(3_GND) I13.3-GND(3_GND) I14.3-GND(3_GND) I15.3-GND(3_GND) I16.3-GND(3_GND) I17.3-GND(3_GND) I18.3-GND(3_GND) I19.3-GND(3_GND) I20.3-GND(3_GND) I21.3-GND(3_GND) I22.3-GND(3_GND) I23.3-GND(3_GND) I24.3-GND(3_GND) I25.3-GND(3_GND) I26.3-GND(3_GND) I27.3-GND(3_GND) I28.3-GND(3_GND) I29.3-GND(3_GND) I30.3-GND(3_GND) I31.3-GND(3_GND) I32.3-GND(3_GND) I33.3-GND(3_GND) I34.3-GND(3_GND) I35.3-GND(3_GND) I36.3-GND(3_GND) I37.3-GND(3_GND) I38.3-GND(3_GND) I39.3-GND(3_GND) I40.3-GND(3_GND) I41.3-GND(3_GND) I42.3-GND(3_GND) I43.3-GND(3_GND) I44.G LS.1(!OE) LS.3(3_GND) R27.1 R29.2 U4.2(GND) U$4.1 U$5.1 ; also sheet 1,2,3
LED1ST: LS.2(A_DIN) R11.1
N$3: I9.2-DOUT(2_DOUT) I10.4-DIN(4_DIN)
N$4: I32.2-DOUT(2_DOUT) I33.4-DIN(4_DIN)
N$5: I33.2-DOUT(2_DOUT) I34.4-DIN(4_DIN)
N$6: I34.2-DOUT(2_DOUT) I35.4-DIN(4_DIN)
N$7: I35.2-DOUT(2_DOUT) I36.4-DIN(4_DIN)
N$8: I36.2-DOUT(2_DOUT) I37.4-DIN(4_DIN)
N$11: I37.2-DOUT(2_DOUT) I38.4-DIN(4_DIN)
N$12: I38.2-DOUT(2_DOUT) I39.4-DIN(4_DIN)
N$13: I39.2-DOUT(2_DOUT) I40.4-DIN(4_DIN)
N$14: I23.2-DOUT(2_DOUT) I24.4-DIN(4_DIN)
N$15: I24.2-DOUT(2_DOUT) I25.4-DIN(4_DIN)
N$16: I25.2-DOUT(2_DOUT) I26.4-DIN(4_DIN)
N$17: I26.2-DOUT(2_DOUT) I27.4-DIN(4_DIN)
N$18: I27.2-DOUT(2_DOUT) I28.4-DIN(4_DIN)
N$20: I29.2-DOUT(2_DOUT) I30.4-DIN(4_DIN)
N$21: I30.2-DOUT(2_DOUT) I31.4-DIN(4_DIN)
N$22: I20.2-DOUT(2_DOUT) I21.4-DIN(4_DIN)
N$23: I10.2-DOUT(2_DOUT) I11.4-DIN(4_DIN)
N$24: I11.2-DOUT(2_DOUT) I12.4-DIN(4_DIN)
N$25: I12.2-DOUT(2_DOUT) I13.4-DIN(4_DIN)
N$26: I13.2-DOUT(2_DOUT) I14.4-DIN(4_DIN)
N$27: I14.2-DOUT(2_DOUT) I15.4-DIN(4_DIN)
N$28: I15.2-DOUT(2_DOUT) I16.4-DIN(4_DIN)
N$29: I16.2-DOUT(2_DOUT) I17.4-DIN(4_DIN)
N$30: I41.4-DIN(4_DIN)
N$31: I5.2-DOUT(2_DOUT) I6.4-DIN(4_DIN)
N$32: I6.2-DOUT(2_DOUT) I7.4-DIN(4_DIN)
N$33: I7.2-DOUT(2_DOUT) I8.4-DIN(4_DIN)
N$34: I8.2-DOUT(2_DOUT) I9.4-DIN(4_DIN)
N$36: I31.2-DOUT(2_DOUT) I32.4-DIN(4_DIN)
N$37: I43.2-DOUT(2_DOUT) I44.D
N$38: R27.2 U4.5(ILIM)
N$40: I19.2-DOUT(2_DOUT) I20.4-DIN(4_DIN)
N$41: I41.2-DOUT(2_DOUT) I42.4-DIN(4_DIN)
N$42: I28.2-DOUT(2_DOUT) I29.4-DIN(4_DIN)
N$46: I1.2-DOUT(2_DOUT) I2.4-DIN(4_DIN)
N$47: I42.2-DOUT(2_DOUT) I43.4-DIN(4_DIN)
N$48: I21.2-DOUT(2_DOUT) I22.4-DIN(4_DIN)
N$49: I22.2-DOUT(2_DOUT) I23.4-DIN(4_DIN)
N$50: I2.2-DOUT(2_DOUT) I3.4-DIN(4_DIN)
N$51: I3.2-DOUT(2_DOUT) I4.4-DIN(4_DIN)
N$52: I4.2-DOUT(2_DOUT) I5.4-DIN(4_DIN)
N$54: I17.2-DOUT(2_DOUT) I18.4-DIN(4_DIN)
N$55: I18.2-DOUT(2_DOUT) I19.4-DIN(4_DIN)
N$66: LS.4(Y_DOUT) R12.2
VCC_1: C45.1 R28.1 U4.1(IN) ; supply symbol labelled 5V ; also sheet 1
Unconnected: I40.2-DOUT(2_DOUT) U$4.NC1(M) U$4.NC2(M) U$5.NC1(M) U$5.NC2(M)

### Notes on the sheet
- USB = 500mA Max, Rlim = 75K
  = 74.25 @ 1% = 319mA - 401mA range

## Library data of the parts
C1-C19 C25-C27 C29-C37 C44-C50 = rcl:C-EU: CAPACITOR, European symbol; SPICEPREFIX: C
C20 C23 = SparkFun-Capacitors:0.22UF: 0.22µF ceramic capacitors A capacitor is a passive two-terminal electrical component used to store electrical energy temporarily in an electric field.; PROD_ID: CAP-07822; VALUE: 0.22uF
C21 C22 C28 C38-C43 = SparkFun-Capacitors:0.1UF: 0.1µF ceramic capacitors A capacitor is a passive two-terminal electrical component used to store electrical energy temporarily in an electric field.; PROD_ID: CAP-08604; VALUE: 0.1uF
C24 = SparkFun-Capacitors:1.0NF/1000PF: 1nF/1,000pF ceramic capacitors A capacitor is a passive two-terminal electrical component used to store electrical energy temporarily in an electric field.; PROD_ID: CAP-07886; VALUE: 1nF
D00 = jlcpcb_basic_parts:1N5819WS: JLCPCB Part # C8598 Description 40V 600mV@1A 1A SOD-123 Schottky Barrier Diodes (SBD) ROHS Schottky Diode
D107 = SparkFun-LED:LED-BLUE: Blue SMD LED Used in manufacturing of various products at SparkFun Packages: 0603 - SMD 0603 package [Product Link] <http://www.digikey.com/product-detail/en/SMLE12BC7TT86/511-1589-2-ND/1641808> 1206 - SMD1206 package [Product Link] <http://www.digikey.com/product-detail/en/lite-on-inc/LTST-C150TBKT/160-1643-1-ND/573584> SparkFun Products: ESP8266 Thing-Dev Board <https://www.sparkfun.com/products/13711> RedBoard <https://www.sparkfun.com/products/12757>; PROD_ID: DIO-08575
D201 D202 = adafruit:DIODE: Diode SMADIODE - SMA Surface Mount Package 20V 1A Schottky Diode Digikey: 641-1014-6-ND DO-1N4148 - Through Hole Small Current Diode SOD-123 20V 1 A (.5mV Vf) Schottky Diode - Digikey: MBRX120TPMSCT-ND SOD-323 10V 570mA (.38mV Vf, 3ns) Schottky Diode - Digikey: ZLLS410CT-ND SOD-523 30V 30mA Schottky Diode (RB751S-40TE61) - Digikey: RB751S-40TE61CT-ND SOT23-R/W - SOT23 Package (R = Solder Paste/Reflow Ovens, W = Hand-Soldering) BAT54Film 40V 300mA - Digikey: 497-7162-1-ND
H_SPC_1 H_SPC_2 = ts_keyboards:MX-STABS-200U
I1-I43 = ts_keyboards:SK6812-E-REVERSE
I44 = __temp_to_delete:ARGB
J1 = SparkFun-Connectors:CONN_02: Multi connection point. Often used as Generic Header-pin footprint for 0.1 inch spaced/style header connections On any of the 0.1 inch spaced packages, you can populate with these: Break Away Headers - Straight <https://www.sparkfun.com/products/116> (PRT-00116) Break Away Male Headers - Right Angle <https://www.sparkfun.com/products/553> (PRT-00553) Female Headers <https://www.sparkfun.com/products/115> (PRT-00115) Break Away Headers - Machine Pin <https://www.sparkfun.com/products/117> (PRT-00117) Break Away Female Headers - Swiss Machine Pin <https://www.sparkfun.com/products/743> (PRT-00743) For SCREWTERMINALS and SPRING TERMINALS visit here: Screw Terimnals on SparkFun.com <https://www.sparkfun.com/search/results?term=Screw+Terminals> (5mm/3.5mm/2.54mm spacing) This device is also useful as a general connection point to wire up your design to another part of your project. Our various solder wires solder well into these plated through hole pads. Hook-Up Wire - Assortment (Stranded, 22 AWG) <https://www.sparkfun.com/products/11375> (PRT-11375) Hook-Up Wire - Assortment (Solid Core, 22 AWG) <https://www.sparkfun.com/products/11367> (PRT-11367) View the entire wire category on our website here <https://www.sparkfun.com/categories/141> Special notes: Molex polarized connector foot print use with: PRT-08233 with associated crimp pins and housings. 2.54_SCREWTERM for use with PRT-10571. 3.5mm Screw Terminal footprints for PRT-08084 5mm Screw Terminal footprints for use with PRT-08432
JSPI = SparkFun-Connectors:AVR_SPI_PROG_3X2: AVR ISP 6 Pin This is the reduced ISP connector for AVR programming. Common on Arduino. This footprint will take up less PCB space and can be used with a 10-pin to 6-pin adapter such as SKU: BOB-08508 **Special note about "TEST_POINT" package. The stop mask is on the top side, so if you want your programming test points to be on the bottom of your board, make sure to place this package on the bottom side of the board. This also ensure that the orientation to program from the bottom side will be correct. SparkFun Products: SparkFun ISP Pogo Adapter <https://www.sparkfun.com/products/11591> - NS Tiny AVR Programmer <https://www.sparkfun.com/products/11801> -PTH
JSPI@2 JSPI@3 = SparkFun-Connectors:CONN_01: Single connection point. Often used as Generic Header-pin footprint for 0.1 inch spaced/style header connections On any of the 0.1 inch spaced packages, you can populate with these: Break Away Headers - Straight <https://www.sparkfun.com/products/116> (PRT-00116) Break Away Male Headers - Right Angle <https://www.sparkfun.com/products/553> (PRT-00553) Female Headers <https://www.sparkfun.com/products/115> (PRT-00115) Break Away Headers - Machine Pin <https://www.sparkfun.com/products/117> (PRT-00117) Break Away Female Headers - Swiss Machine Pin <https://www.sparkfun.com/products/743> (PRT-00743) This device is also useful as a general connection point to wire up your design to another part of your project. Our various solder wires solder well into these plated through hole pads. Hook-Up Wire - Assortment (Stranded, 22 AWG) <https://www.sparkfun.com/products/11375> (PRT-11375) Hook-Up Wire - Assortment (Solid Core, 22 AWG) <https://www.sparkfun.com/products/11367> (PRT-11367) View the entire wire category on our website here <https://www.sparkfun.com/categories/141> Special notes: SMTSO-256-ET is a "flush mount" nut for a 4-40 screw. We mostly use this on specialty testbeds; it is a nice way to connect hardware to your PCB at an adjustable hieght. Also note, the SNAP packages are for using a snappable style connector. We sell a baggie of snaps and they are also used on two LilyPad designs: Snap Assortment - 30 pack (male and female) <https://www.sparkfun.com/products/11347> (DEV-11347) LilyPad Arduino SimpleSnap <https://www.sparkfun.com/products/10941> (DEV-10941) LilyPad SimpleSnap Protoboard <https://www.sparkfun.com/products/10940> (DEV-10940)
JTAG = SparkFun-Connectors:CONN_05X2: Multi connection point. Often used as Generic Header-pin footprint for 0.1 inch spaced/style header connections For AVR SPI programming port, see special device with nice symbol: "AVR_SPI_PROG_5x2.dev" You can populate with any combo of single row headers, but if you'd like an exact match, check these: 2x5 AVR ICSP Male Header <https://www.sparkfun.com/products/778> (PRT-00778) 2x5 Pin Shrouded Header <https://www.sparkfun.com/products/8506> (PRT-08506) On any of the 0.1 inch spaced packages, you can populate with these: Break Away Headers - Straight <https://www.sparkfun.com/products/116> (PRT-00116) Break Away Male Headers - Right Angle <https://www.sparkfun.com/products/553> (PRT-00553) Female Headers <https://www.sparkfun.com/products/115> (PRT-00115) Break Away Headers - Machine Pin <https://www.sparkfun.com/products/117> (PRT-00117) Break Away Female Headers - Swiss Machine Pin <https://www.sparkfun.com/products/743> (PRT-00743) Special note: the shrouded connector mates well with our 5x2 ribbon cables: 2x5 Pin IDC Ribbon Cable <https://www.sparkfun.com/products/8535> (PRT-08535)
L1 = rcl:L-US: INDUCTOR, American symbol; SPICEPREFIX: L
LM1117 = SparkFun-IC-Power:V_REG_LM1117: Voltage Regulator LM1117 Standard adjustable voltage regulator but in SMD form. Spark Fun Electronics SKU : COM-00595; PROD_ID: VREG-08170
LS = ts_keyboards:74AHCT1G125GW
M0 M1-M5 = __untitled:74HC589A_DT
Q1 = adafruit:MOSFET-N: N-Channel Mosfet 2N7002E - 60V 260mA SOT23 [Digikey: 2N7002ET1GOSTR-ND] - REEL BSH103 - 30V 850mA SOT23 [Digikey: 568-5013-1-ND]
Q2 = SparkFun-DiscreteSemi:MOSFET_PCH: P-channel MOSFETs Voltage controlled devices that allow control of high current outputs. SparkFun Products: SparkFun ESP32 Thing <https://www.sparkfun.com/products/13907> SparkFun ESP8266 Thing <https://www.sparkfun.com/products/13231> SparkFun Pi Servo HAT V2 <https://www.sparkfun.com/products/15316> DMG2305UX-7 (20V/4.2A/SOT23-3); PROD_ID: TRAN-14388; VALUE: 20V/4.2A/52mΩ/1.4W
R1-R13 R26-R29 = rcl:R-EU_: RESISTOR, European symbol; SPICEPREFIX: R
R14-R25 = ts_keyboards:R-EU-4
S1 = SparkFun-Switches:MOMENTARY-SWITCH-SPST: Momentary Switch (Pushbutton) - SPST Normally-open (NO) SPST momentary switches (buttons, pushbuttons). Variants PTH-12MM - 12mm square, through-hole Momentary Pushbutton Switch - 12mm Square <https://www.sparkfun.com/products/9190> (COM-09190) PTH-6.0MM, PTH-6.0MM-KIT - 6.0mm square, through-hole Mini Pushbutton Switch <https://www.sparkfun.com/products/97> (COM-00097) KIT package intended for soldering kit's - only one side of pads' copper is exposed. PTH-RIGHT-ANGLE-KIT - Right-angle, through-hole Right Angle Tactile Button <https://www.sparkfun.com/products/10791> - Used on SparkFun BigTime Watch Kit <https://www.sparkfun.com/products/11734> SMD-12MM - 12mm square, surface-mount Tactile Button - SMD (12mm) <https://www.sparkfun.com/products/12993> (COM-12993) Used on SparkFun PicoBoard <https://www.sparkfun.com/products/11888> SMD-4.5MM - 4.5mm Square Trackball Switch Used on SparkFun Blackberry Trackballer Breakout <https://www.sparkfun.com/products/13169> SMD-4.6MMX2.8MM - 4.60mm x 2.80mm, surface mount Used on SparkFun SAMD21 Mini Breakout <https://www.sparkfun.com/products/13664> SMD-5.2MM, SMD-5.2-REDUNDANT - 5.2mm square, surface-mount Mini Pushbutton Switch - SMD <https://www.sparkfun.com/products/8720> (COM-08720) Used on Arduino Pro Mini <https://www.sparkfun.com/products/11114> REDUNDANT package connects both switch circuits together SMD-6.0X3.5MM - 6.0 x 3.5mm, surface mount Momentary Reset Switch SMD <https://www.sparkfun.com/products/8229> (COM-08229) SMD-6.2MM-TALL - 6.2mm square, surface mount Tactile Button - SMD (6mm) <https://www.sparkfun.com/products/12992> Used on SparkFun Digital Sandbox <https://www.sparkfun.com/products/12651> SMD-RIGHT-ANGLE - Right-angle, surface mount Used on SparkFun Block for Intel® Edison - Arduino <https://www.sparkfun.com/products/13036>; PROD_ID: SWCH-14139
SW_A SW_B SW_BSP SW_C SW_D SW_DEL SW_DN SW_E SW_ENT SW_ESC SW_F SW_G SW_H SW_I SW_J SW_K SW_L SW_LA SW_LC SW_LF SW_LS SW_LW SW_M SW_N SW_O SW_P SW_Q SW_R SW_RS SW_RT SW_S SW_SPC_1 SW_SPC_2 SW_T SW_TAB SW_U SW_UP SW_V SW_W SW_X SW_Y SW_Z = ts_keyboards:MX-5-PIN-HOTSWAP-PAD
U1 = st:STM32F405RGT6
U2 = ts_kb_mcu:USB3300-EZK; COPYRIGHT: Copyright (C) 2023 Ultra Librarian. All rights reserved.; MANUFACTURER_PART_NUMBER: USB3300-EZK; MFR_NAME: Microchip
U3 = ts_kb_mcu:TS3USB221A-Q1; COPYRIGHT: Copyright (C) 2023 Ultra Librarian. All rights reserved.; MANUFACTURER_PART_NUMBER: TS3USB221AQRSERQ1; MFR_NAME: Texas Instruments
U4 = __untitled:TPS2553DBVR-1; COPYRIGHT: Copyright (C) 2024 Ultra Librarian. All rights reserved.; MANUFACTURER_PART_NUMBER: TPS2553DBVR-1; MFR_NAME: Texas Instruments; REFDES: RefDes; TYPE: TYPE
U4X = ts_kb_mcu:M25C
U$1 U$6 = __temp_to_delete:VR42_MLB_FOOTPRINT
U$2 U$3 = molex-pico-ezmate:MOLEX_0781710005
U$4 U$5 = molex-pico-ezmate:MOLEX_0781710003
U$7 = __temp_to_delete:UBD_FOOTPRINT
UDB1 = ts_keyboards:UBD-S1_C4: SMD 1.2mm pitch Molex Pico-EZmate 4P connector
UDB2 = ts_keyboards:UBD-C3: SMD 1mm pitch JST SH 4P connector
Y1 = SparkFun-Clocks:CRYSTAL-32.768KHZ: 32.768kHz Crystal Frequency: 32.768kHz Frequency Stability: ±20ppm Load Capacitance: 12.5pF (PTH-2X6 & SMD-3.2X1.5), 6pF (SMD-2X6) SparkFun Products: SparkFun BigTime Watch Kit <https://www.sparkfun.com/products/11734> SparkFun nRF52832 Breakout <https://www.sparkfun.com/products/13990> SparkFun Real Time Clock Module <https://www.sparkfun.com/products/12708>; PROD_ID: XTAL-13062; VALUE: 32.768kHz
Y2 = SparkFun-Clocks:CRYSTAL-24MHZ: 24MHz Crystal Datasheet <http://www.sparkfun.com/datasheets/Components/AT-SMD-5x3.pdf> Frequency: 24MHz Frequency Tolerance: ±20ppm Load Capacitance: 12pF SparkFun Products: USB Bit Whacker <https://www.sparkfun.com/products/762>; PROD_ID: XTAL-08298; SF_ID: COM-08581; VALUE: 24MHz
Y3 = SparkFun-Clocks:CRYSTAL-24MHZ: 24MHz Crystal Datasheet <http://www.sparkfun.com/datasheets/Components/AT-SMD-5x3.pdf> Frequency: 24MHz Frequency Tolerance: ±20ppm Load Capacitance: 12pF SparkFun Products: USB Bit Whacker <https://www.sparkfun.com/products/762>; PROD_ID: XTAL-08298; SF_ID: COM-08581

## Board
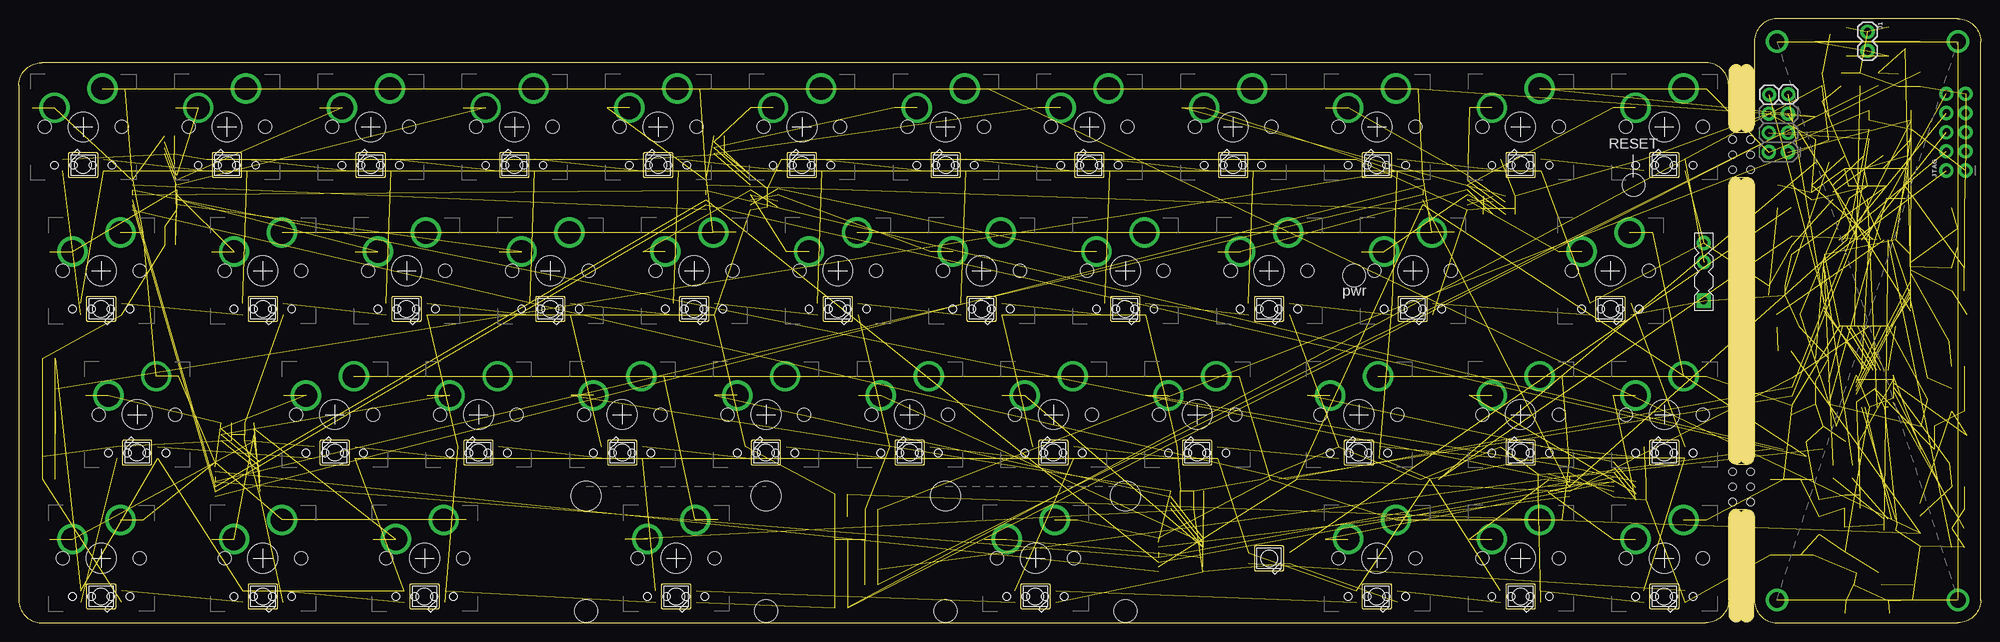
[diagram p4: board, top side]
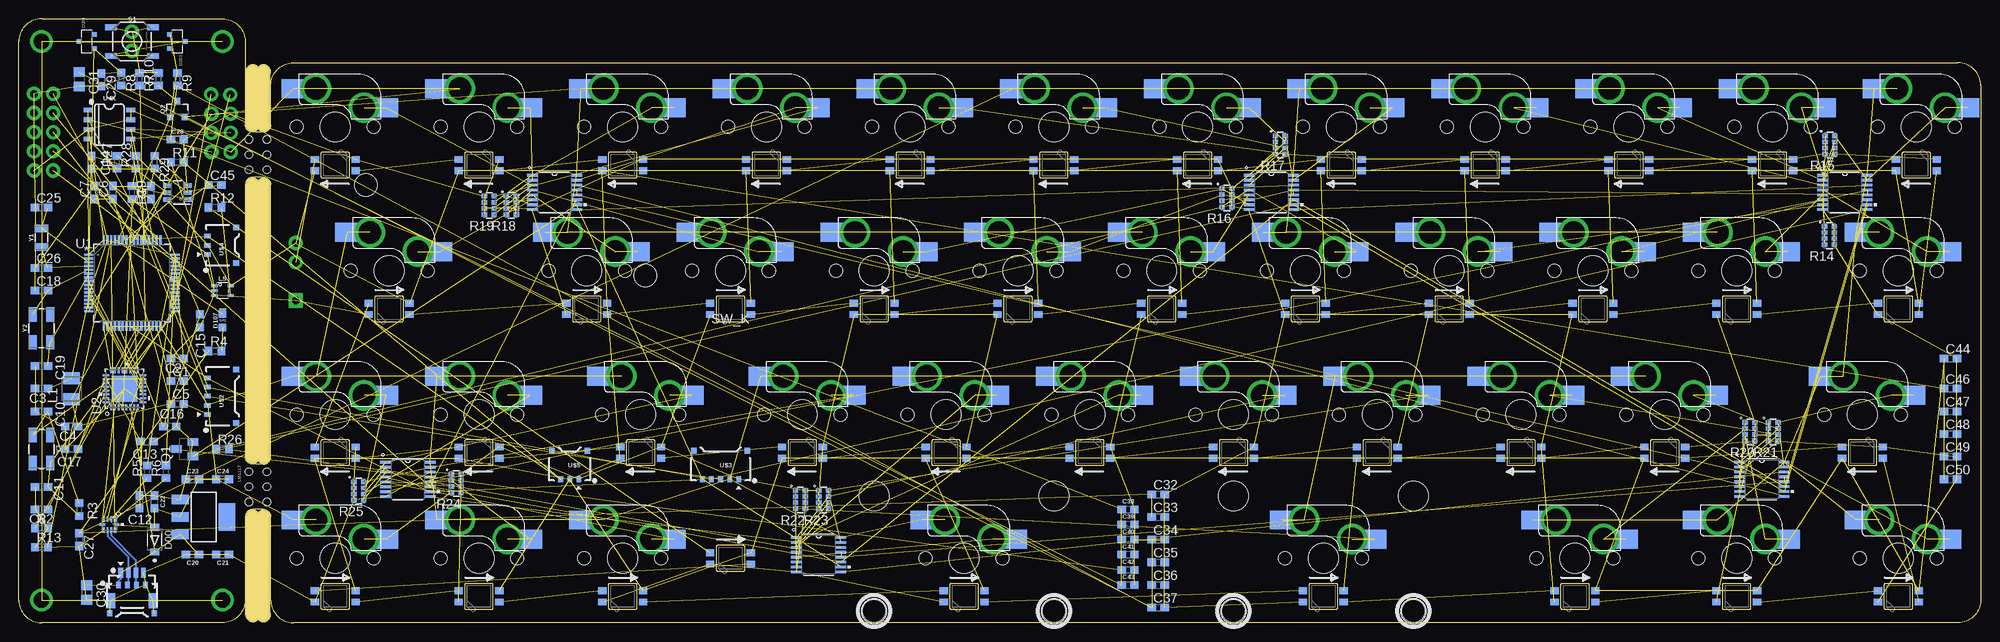
[diagram p5: board, bottom side, seen from below]

Size 260 x 80 mm. Coordinates in mm from the lower left corner, seen from the top.
Outline: 3,0 223.6,0 arc90 226.6,3 226.6,14 arc-90 227.6,15 229,15 arc-90 230,14 230,3 arc90 233,0 257,0 arc90 260,3 260,77 arc90 257,80 233,80 arc90 230,77 230,66 arc-90 229,65 227.6,65 arc-90 226.6,66 226.6,71.2 arc90 223.6,74.2 3,74.2 arc90 0,71.2 0,3 arc90 3,0
Outline: 226.6,22 226.6,58 arc-90 227.6,59 229,59 arc-90 230,58 230,22 arc-90 229,21 227.6,21 arc-90 226.6,22
Copper layers (1*16): Top 0.035mm / dielectric 1.5mm / Bottom 0.035mm
Design rules "default": minimum track width 6mil, minimum drill 0.35mm, track to track 6mil, track to pad 6mil, pad to pad 6mil, via to via 6mil, smd to smd 6mil, copper to edge 40mil, drill to drill 6mil, minimum pad ring 10mil, minimum via ring 8mil, stop-mask expansion 4mil, vias tented up to drill 0mil, thermal gap 10mil
Holes 1 mm at 229.5,64 229.5,62 227.1,64 227.1,62 227.1,60 229.5,60 229.5,20 229.5,18 227.1,20 227.1,18 227.1,16 229.5,16
Holes 3 mm at 214,58 177,46
Milling: 6 lines

### Footprints (pad centres in the part's own frame; a part is rotated, then mirrored left to right if it is on the bottom)
C0603 = smd 1.1 x 1: 1 -0.85,0; 2 0.85,0
0603 = smd 1.1 x 1: 1 -0.85,0; 2 0.85,0
C0805 = smd 1.3 x 1.5: 1 -0.95,0; 2 0.95,0
SOD-123 = smd 0.914 x 1.219: A 1.638,0; C -1.638,0
LED-0603 = smd 1 x 1: A -0.877,0; C 0.877,0
SOT23-R = smd 0.6 x 0.7: 1 -0.95,-1; 2 0.95,-1; 3 0,1
MX-STABS-200U = hole 3.988: -11.938,8.255; 11.938,8.255 | hole 3.048: -11.938,-6.985; 11.938,-6.985
SK6812-E-MILL = smd 1.1 x 0.9 bottom: 1-VDD 2.7,-0.749; 2-DOUT 2.7,0.751; 3-GND -2.7,0.751; 4-DIN -2.7,-0.749
ARGB = drill 1.016 pad 1.88: D 2.54,0; V 0,0 | drill 1.016 pad 1.88 square: G 7.62,0
1X02 = drill 1.016 pad 1.88: 1 0,0; 2 2.54,0
2X3-NS = drill 1.016 pad 1.88: 1 -2.54,-1.27; 2 -2.54,1.27; 3 0,-1.27; 4 0,1.27; 5 2.54,-1.27; 6 2.54,1.27
1X01 = drill 1.016 pad 1.88: 1 0,0
2X5_NOSILK = drill 1.016 pad 1.88: 1 0,0; 2 0,2.54; 3 2.54,0; 4 2.54,2.54; 5 5.08,0; 6 5.08,2.54; 7 7.62,0; 8 7.62,2.54; 9 10.16,0; 10 10.16,2.54
L3225M = smd 1.6 x 2.2: 1 -1.4,0; 2 1.4,0
SOT223 = smd 1.219 x 2.235: 1 -2.311,-3.099; 2 0,-3.099; 3 2.311,-3.099 | smd 3.6 x 2.2: 4 0,3.099
SC-88A__TSSOP5__SOT353-1 = smd 0.375 x 0.825: 1 -0.65,-1.087; 2 0,-1.087; 3 0.65,-1.087; 4 0.65,1.087; 6 -0.65,1.087
TSSOP16 = smd 1.408 x 0.356: 1 -2.952,2.275; 2 -2.952,1.625; 3 -2.952,0.975; 4 -2.952,0.325; 5 -2.952,-0.325; 6 -2.952,-0.975; 7 -2.952,-1.625; 8 -2.952,-2.275; 9 2.952,-2.275; 10 2.952,-1.625; 11 2.952,-0.975; 12 2.952,-0.325; 13 2.952,0.325; 14 2.952,0.975; 15 2.952,1.625; 16 2.952,2.275
SOT23 = smd 1 x 1.4: 1 -0.95,-1.1; 2 0.95,-1.1; 3 0,1.1
SOT23-3 = smd 0.8 x 0.9: 1 -0.95,-1; 2 0.95,-1; 3 0,1.1
R0603 = smd 1 x 1.1: 1 -0.85,0; 2 0.85,0
R0603X4 = smd 0.7 x 0.6: 1 -0.65,1.2; 2 -0.65,0.4; 3 -0.65,-0.4; 4 -0.65,-1.2; 5 0.65,-1.2; 6 0.65,-0.4; 7 0.65,0.4; 8 0.65,1.2
TACTILE_SWITCH_SMD_5.2MM = smd 1.524 x 0.762: 1 -2.794,1.905; 2 2.794,1.905; 3 -2.794,-1.905; 4 2.794,-1.905
MX-5-PIN-HOTSWAP-PAD = smd 3.15 x 2.5 bottom: 1@1 -6.785,2.54; 2@1 5.542,5.08 | drill 3 pad 3.75: 1@2 -3.81,2.54; 2@2 2.54,5.08 | hole 3.988: 0,0 | hole 1.75: -5.08,0; 5.08,0
LQFP64-10X10MM = smd 1.194 x 0.305: 1 -5.75,3.75; 2 -5.75,3.25; 3 -5.75,2.75; 4 -5.75,2.25; 5 -5.75,1.75; 6 -5.75,1.25; 7 -5.75,0.75; 8 -5.75,0.25; 9 -5.75,-0.25; 10 -5.75,-0.75; 11 -5.75,-1.25; 12 -5.75,-1.75; 13 -5.75,-2.25; 14 -5.75,-2.75; 15 -5.75,-3.25; 16 -5.75,-3.75; 33 5.75,-3.75; 34 5.75,-3.25; 35 5.75,-2.75; 36 5.75,-2.25; 37 5.75,-1.75; 38 5.75,-1.25; 39 5.75,-0.75; 40 5.75,-0.25; 41 5.75,0.25; 42 5.75,0.75; 43 5.75,1.25; 44 5.75,1.75; 45 5.75,2.25; 46 5.75,2.75; 47 5.75,3.25; 48 5.75,3.75 | smd 0.305 x 1.194: 17 -3.75,-5.75; 18 -3.25,-5.75; 19 -2.75,-5.75; 20 -2.25,-5.75; 21 -1.75,-5.75; 22 -1.25,-5.75; 23 -0.75,-5.75; 24 -0.25,-5.75; 25 0.25,-5.75; 26 0.75,-5.75; 27 1.25,-5.75; 28 1.75,-5.75; 29 2.25,-5.75; 30 2.75,-5.75; 31 3.25,-5.75; 32 3.75,-5.75; 49 3.75,5.75; 50 3.25,5.75; 51 2.75,5.75; 52 2.25,5.75; 53 1.75,5.75; 54 1.25,5.75; 55 0.75,5.75; 56 0.25,5.75; 57 -0.25,5.75; 58 -0.75,5.75; 59 -1.25,5.75; 60 -1.75,5.75; 61 -2.25,5.75; 62 -2.75,5.75; 63 -3.25,5.75; 64 -3.75,5.75
QFN32_5X5MC_MCH = smd 0.813 x 0.254: 1 -2.451,1.778; 2 -2.451,1.27; 3 -2.451,0.762; 4 -2.451,0.254; 5 -2.451,-0.254; 6 -2.451,-0.762; 7 -2.451,-1.27; 8 -2.451,-1.778; 17 2.451,-1.778; 18 2.451,-1.27; 19 2.451,-0.762; 20 2.451,-0.254; 21 2.451,0.254; 22 2.451,0.762; 23 2.451,1.27; 24 2.451,1.778 | smd 0.254 x 0.813: 9 -1.778,-2.451; 10 -1.27,-2.451; 11 -0.762,-2.451; 12 -0.254,-2.451; 13 0.254,-2.451; 14 0.762,-2.451; 15 1.27,-2.451; 16 1.778,-2.451; 25 1.778,2.451; 26 1.27,2.451; 27 0.762,2.451; 28 0.254,2.451; 29 -0.254,2.451; 30 -0.762,2.451; 31 -1.27,2.451; 32 -1.778,2.451 | smd 3.404 x 3.404: 33 0,0
RSE10 = smd 0.705 x 0.3: 1 -0.727,0.75; 4 -0.727,-0.75; 6 0.727,-0.75; 9 0.727,0.75 | smd 0.705 x 0.25: 2 -0.727,0.25; 3 -0.727,-0.25; 7 0.727,-0.25; 8 0.727,0.25 | smd 0.35 x 0.755: 5 0,-0.952; 10 0,0.952
DBV0006A_N = smd 1 x 0.6: 1 -1.375,0.95; 2 -1.375,0; 3 -1.375,-0.95; 4 1.375,-0.95; 5 1.375,0; 6 1.375,0.95
8-SOIC = smd 0.6 x 1.2: 1 -1.905,-2.8; 2 -0.635,-2.8; 3 0.635,-2.8; 4 1.905,-2.8; 5 1.905,2.8; 6 0.635,2.8; 7 -0.635,2.8; 8 -1.905,2.8
MOLEX_781710005 = smd 0.6 x 0.85: 1 -2.4,2; 2 -1.2,2; 3 0,2; 4 1.2,2; 5 2.4,2 | smd 0.7 x 0.8: NC1 -3.55,-1.775; NC2 3.55,-1.775
MOLEX_781710003 = smd 0.6 x 0.85: 1 -1.2,2; 2 0,2; 3 1.2,2 | smd 0.7 x 0.8: NC1 -2.35,-1.775; NC2 2.35,-1.775
MOLEX_781710004 = smd 0.6 x 0.85: 1 -1.8,2; 2 -0.6,2; 3 0.6,2; 4 1.8,2 | smd 0.7 x 0.8: NC1 -2.95,-1.775; NC2 2.95,-1.775
JST_SM04B-SRSS-TB_LF_SN = smd 0.6 x 1.35: 1 -1.5,0; 2 -0.5,0; 3 0.5,0; 4 1.5,0 | smd 1.2 x 2: NC1 2.8,-3.675; NC2 -2.8,-3.675
CRYSTAL-SMD-3.2X1.5MM = smd 1 x 1.8: P$1 -1.25,0; P$2 1.25,0
CRYSTAL-SMD-5X3.2-4PAD = smd 1.9 x 1.1: 1 -1.85,-1.15; 2 1.85,-1.15; 3 1.85,1.15; 4 -1.85,1.15

### Placement (x,y rotation side)
C1  239,32 0 bottom
C2  239,35 180 bottom
C3  257,31 180 bottom
C4  253,26 180 bottom
C5  239,29 0 bottom
C6  247.5,57 90 bottom
C7  250,57 90 bottom
C8  257,15 180 bottom
C9  242.5,57 90 bottom
C10  257,28 180 bottom
C11  257,18 180 bottom
C12  244,16 90 bottom
C13  243,24 0 bottom
C14  250.4,61 270 bottom
C15  236,40 270 bottom
C16  240,26 0 bottom
C17  253,23 180 bottom
C18  257,44 0 bottom
C19  257,34 0 bottom
C20  237,9 180 bottom
C21  233,9 0 bottom
C22  242,16 90 bottom
C23  237,19 180 bottom
C24  233,19 0 bottom
C25  257,55 0 bottom
C26  257,47 0 bottom
C27  252,11 270 bottom
C28  239,64 0 bottom
C29  249.06,71.91 270 bottom
C30  251,4 270 bottom
C31  252,72 270 bottom
C32  109,17 0 bottom
C33  109,14 0 bottom
C34  109,11 0 bottom
C35  109,8 0 bottom
C36  109,5 0 bottom
C37  109,2 0 bottom
C38  113,15 0 bottom
C39  113,13 0 bottom
C40  113,11 0 bottom
C41  113,9 0 bottom
C42  113,7 0 bottom
C43  113,5 0 bottom
C44  4,35 0 bottom
C45  234,58 0 bottom
C46  4,31 0 bottom
C47  4,28 0 bottom
C48  4,25 0 bottom
C49  4,22 0 bottom
C50  4,19 0 bottom
D00  242,11 90 bottom
D107  233,40 90 bottom
D201  251,77 90 bottom
D202  239,77 270 bottom
H_SPC_1  87.11,8.53 0 top
H_SPC_2  134.73,8.53 0 top
I1  165.69,8.53 180 top
I2  218.07,3.47 180 top
I3  199.03,3.47 180 top
I4  179.97,3.47 180 top
I5  134.73,3.47 180 top
I6  87.11,3.47 180 top
I7  53.77,3.47 180 top
I8  32.34,3.47 180 top
I9  10.91,3.47 180 top
I10  15.67,22.52 0 top
I11  41.86,22.52 0 top
I12  60.91,22.52 0 top
I13  79.96,22.52 0 top
I14  99.01,22.52 0 top
I15  118.06,22.52 0 top
I16  137.11,22.52 0 top
I17  156.16,22.52 0 top
I18  177.59,22.52 0 top
I19  199.03,22.52 0 top
I20  218.07,22.52 0 top
I21  210.93,41.58 180 top
I22  184.74,41.58 180 top
I23  165.69,41.58 180 top
I24  146.64,41.58 180 top
I25  127.59,41.58 180 top
I26  108.54,41.58 180 top
I27  89.49,41.58 180 top
I28  70.44,41.58 180 top
I29  51.39,41.58 180 top
I30  32.34,41.58 180 top
I31  10.91,41.58 180 top
I32  8.53,60.62 0 top
I33  27.57,60.62 0 top
I34  46.62,60.62 0 top
I35  65.67,60.62 0 top
I36  84.72,60.62 0 top
I37  103.78,60.62 0 top
I38  122.83,60.62 0 top
I39  141.88,60.62 0 top
I40  160.93,60.62 0 top
I41  179.97,60.62 0 top
I42  199.03,60.62 0 top
I43  218.07,60.62 0 top
I44  223.3,50.3 270 top
J1  245,78.3 270 top
JSPI  233.2,64.9 90 top
JSPI@2  234.5,70 180 top
JSPI@3  231.98,69.96 180 top
JTAG  258,59.9 90 top
L1  253,31 90 bottom
LM1117  235.5,14 270 bottom
LS  233,44 270 bottom
M0  18,57 0 bottom
M1  94,57 0 bottom
M2  189,57 0 bottom
M3  29,19 0 bottom
M4  154,9 0 bottom
M5  208.45,18.97 0 bottom
Q1  238,23 90 bottom
Q2  239,68 0 bottom
R1  245,57 270 bottom
R2  257,12.5 0 bottom
R3  252,15 270 bottom
R4  234,36 0 bottom
R5  243,20 90 bottom
R6  240.5,20 90 bottom
R7  244,72 270 bottom
R8  246.44,72.01 270 bottom
R9  239,72 270 bottom
R10  241.5,72 90 bottom
R11  239,61 0 bottom
R12  234,55 0 bottom
R13  257,10 0 bottom
R14  20.05,51.3 0 bottom
R15  19.97,63.3 0 bottom
R16  99.89,56.3 0 bottom
R17  92.81,63.3 0 bottom
R18  194.73,55.3 0 bottom
R19  197.65,55.3 0 bottom
R20  30.57,25.3 0 bottom
R21  27.49,25.3 0 bottom
R22  156.41,16.3 0 bottom
R23  153.33,16.3 0 bottom
R24  202.03,18.46 0 bottom
R25  214.95,17.46 0 bottom
R26  233,23 0 bottom
R27  247,61 90 bottom
R28  244.5,61 90 bottom
R29  242,61 270 bottom
S1  245,77 0 bottom
SW_A  32.34,46.62 0 top
SW_B  118.06,27.57 0 top
SW_BSP  218.07,65.67 0 top
SW_C  79.96,27.57 0 top
SW_D  70.44,46.62 0 top
SW_DEL  218.07,27.57 0 top
SW_DN  179.97,8.53 0 top
SW_E  65.67,65.67 0 top
SW_ENT  210.93,46.62 0 top
SW_ESC  8.53,65.67 0 top
SW_F  89.49,46.62 0 top
SW_G  108.54,46.62 0 top
SW_H  127.59,46.62 0 top
SW_I  160.93,65.67 0 top
SW_J  146.64,46.62 0 top
SW_K  165.69,46.62 0 top
SW_L  184.74,46.62 0 top
SW_LA  53.77,8.53 0 top
SW_LC  10.91,8.53 0 top
SW_LF  218.07,8.53 0 top
SW_LS  15.67,27.57 0 top
SW_LW  32.34,8.53 0 top
SW_M  156.16,27.57 0 top
SW_N  137.11,27.57 0 top
SW_O  179.97,65.67 0 top
SW_P  199.03,65.67 0 top
SW_Q  27.57,65.67 0 top
SW_R  84.72,65.67 0 top
SW_RS  177.59,27.57 0 top
SW_RT  199.03,8.53 0 top
SW_S  51.39,46.62 0 top
SW_SPC_1  87.11,8.53 0 top
SW_SPC_2  134.73,8.53 0 top
SW_T  103.78,65.67 0 top
SW_TAB  10.91,46.62 0 top
SW_U  141.88,65.67 0 top
SW_UP  199.03,27.57 0 top
SW_V  99.01,27.57 0 top
SW_W  46.62,65.67 0 top
SW_X  60.91,27.57 0 top
SW_Y  122.83,65.67 0 top
SW_Z  41.86,27.57 0 top
U1  245,45 0 bottom
U2  246,31 90 bottom
U3  248,13 270 bottom
U4  239,57 180 bottom
U4X  248,66 270 bottom
U$1  177,58 180 top
U$2  233,30 90 bottom
U$3  167,21 180 bottom
U$4  233,50 90 bottom
U$5  187,21 180 bottom
U$6  245,40 90 top
U$7  113.3,65 0 top
UDB1  245,3 0 bottom
UDB2  245,6.6 0 bottom
Y1  257,51 90 bottom
Y2  257,39 90 bottom
Y3  257,23 270 bottom

### Tracks (layer width: path | path; a pad name or v marks a point on that pad's centre or on a via)
!ARGB_FAULT  (2 unrouted)
!BOOT  (3 unrouted)
!RESET  (3 unrouted)
ARGB_5V_D  (1 unrouted)
ARGB_D  (3 unrouted)
ARGB_EN  (2 unrouted)
ARGB_PWR  (53 unrouted)
AUX_CS  (1 unrouted)
AUX_DC  (1 unrouted)
AUX_RST  (1 unrouted)
BOOT0  (2 unrouted)
BOOT1  (1 unrouted)
EE_CS  (1 unrouted)
GND  (186 unrouted)
HS_ULPI_CK  (1 unrouted)
HS_ULPI_D0  (1 unrouted)
HS_ULPI_D1  (1 unrouted)
HS_ULPI_D2  (1 unrouted)
HS_ULPI_D3  (1 unrouted)
HS_ULPI_D4  (1 unrouted)
HS_ULPI_D5  (1 unrouted)
HS_ULPI_D6  (1 unrouted)
HS_ULPI_D7  (1 unrouted)
HS_ULPI_DIR  (1 unrouted)
HS_ULPI_NXT  (1 unrouted)
HS_ULPI_STP  (1 unrouted)
JTCK  (1 unrouted)
JTDI  (1 unrouted)
JTDO  (1 unrouted)
JTMS  (1 unrouted)
JTRST  (1 unrouted)
K00  (3 unrouted)
K01  (3 unrouted)
K02  (3 unrouted)
K03  (3 unrouted)
K04  (3 unrouted)
K05  (3 unrouted)
K06  (3 unrouted)
K07  (3 unrouted)
K10  (3 unrouted)
K11  (3 unrouted)
K12  (3 unrouted)
K13  (3 unrouted)
K14  (3 unrouted)
K15  (3 unrouted)
K16  (3 unrouted)
K17  (3 unrouted)
K20  (3 unrouted)
K21  (3 unrouted)
K22  (3 unrouted)
K23  (3 unrouted)
K24  (3 unrouted)
K25  (3 unrouted)
K26  (3 unrouted)
K27  (1 unrouted)
K30  (3 unrouted)
K31  (3 unrouted)
K32  (3 unrouted)
K33  (1 unrouted)
K34  (3 unrouted)
K35  (3 unrouted)
K36  (3 unrouted)
K37  (1 unrouted)
K40  (3 unrouted)
K41  (3 unrouted)
K42  (3 unrouted)
K43  (3 unrouted)
K44  (3 unrouted)
K45  (3 unrouted)
K46  (1 unrouted)
K47  (1 unrouted)
K50  (3 unrouted)
K51  (3 unrouted)
K52  (3 unrouted)
K53  (3 unrouted)
K54  (3 unrouted)
K55  (3 unrouted)
K56  (3 unrouted)
K57  (1 unrouted)
LED  (1 unrouted)
LED1ST  (1 unrouted)
MATRIX_1_2  (1 unrouted)
MATRIX_2_3  (1 unrouted)
MATRIX_3_4  (1 unrouted)
MATRIX_4_5  (1 unrouted)
MATRIX_5_6  (1 unrouted)
MATRIX_CS  (9 unrouted)
MATRIX_LATCH  (13 unrouted)
N$3  (1 unrouted)
N$4  (1 unrouted)
N$5  (1 unrouted)
N$6  (1 unrouted)
N$7  (1 unrouted)
N$8  (1 unrouted)
N$9  (1 unrouted)
N$10  (1 unrouted)
N$11  (1 unrouted)
N$12  (1 unrouted)
N$13  (1 unrouted)
N$14  (1 unrouted)
N$15  (1 unrouted)
N$16  (1 unrouted)
N$17  (1 unrouted)
N$18  (1 unrouted)
N$19  (1 unrouted)
N$20  (1 unrouted)
N$21  (1 unrouted)
N$22  (1 unrouted)
N$23  (1 unrouted)
N$24  (1 unrouted)
N$25  (1 unrouted)
N$26  (1 unrouted)
N$27  (1 unrouted)
N$28  (1 unrouted)
N$29  (1 unrouted)
N$31  (1 unrouted)
N$32  (1 unrouted)
N$33  (1 unrouted)
N$34  (1 unrouted)
N$35  (via drill 2)  (3 unrouted)
  other vias: 233,77 257,3 257,77 233,3
N$36  (1 unrouted)
N$37  (1 unrouted)
N$38  (1 unrouted)
N$40  (1 unrouted)
N$41  (1 unrouted)
N$42  (1 unrouted)
N$46  (1 unrouted)
N$47  (1 unrouted)
N$48  (1 unrouted)
N$49  (1 unrouted)
N$50  (1 unrouted)
N$51  (1 unrouted)
N$52  (1 unrouted)
N$54  (1 unrouted)
N$55  (1 unrouted)
N$66  (1 unrouted)
N$140  (1 unrouted)
N$141  (1 unrouted)
N$145  (1 unrouted)
OSC32_I  (2 unrouted)
OSC32_O  (2 unrouted)
OSC_I  (2 unrouted)
OSC_O  (2 unrouted)
RESET  (4 unrouted)
SPI_MISO  (5 unrouted)
SPI_MOSI  (4 unrouted)
SPI_SCK  (8 unrouted)
ULPI_1V8  (3 unrouted)
ULPI_XI  (3 unrouted)
ULPI_XO  (3 unrouted)
USB1_DN  (1 unrouted)
USB1_DP  (1 unrouted)
USB2_DN  (1 unrouted)
  Bottom 0.254: 244.2,28.53 U2.8
USB2_DP  (1 unrouted)
USB_DN
  Bottom 0.254: U3.7 248.25,11.47 245.5,8.72 UDB2.2 245.5,5.1 UDB1.2
USB_DP
  Bottom 0.254: U3.8 247.75,11.55 244.5,8.3 UDB2.3 244.5,5.1 UDB1.3
USB_SELECT  (2 unrouted)
VCAP_1  (1 unrouted)
VCAP_2  (1 unrouted)
VCC_1  (19 unrouted)
  Bottom 0.254: UDB2.1 246.5,5.8 246.8,5.5 UDB1.1
VCC_2  (131 unrouted)
VDDA  (2 unrouted)

### Text on the board
tPlace: RESET | pwr